# EAGLE design VCU (EAGLE 9.2.2)

## Sheet 1 of 7
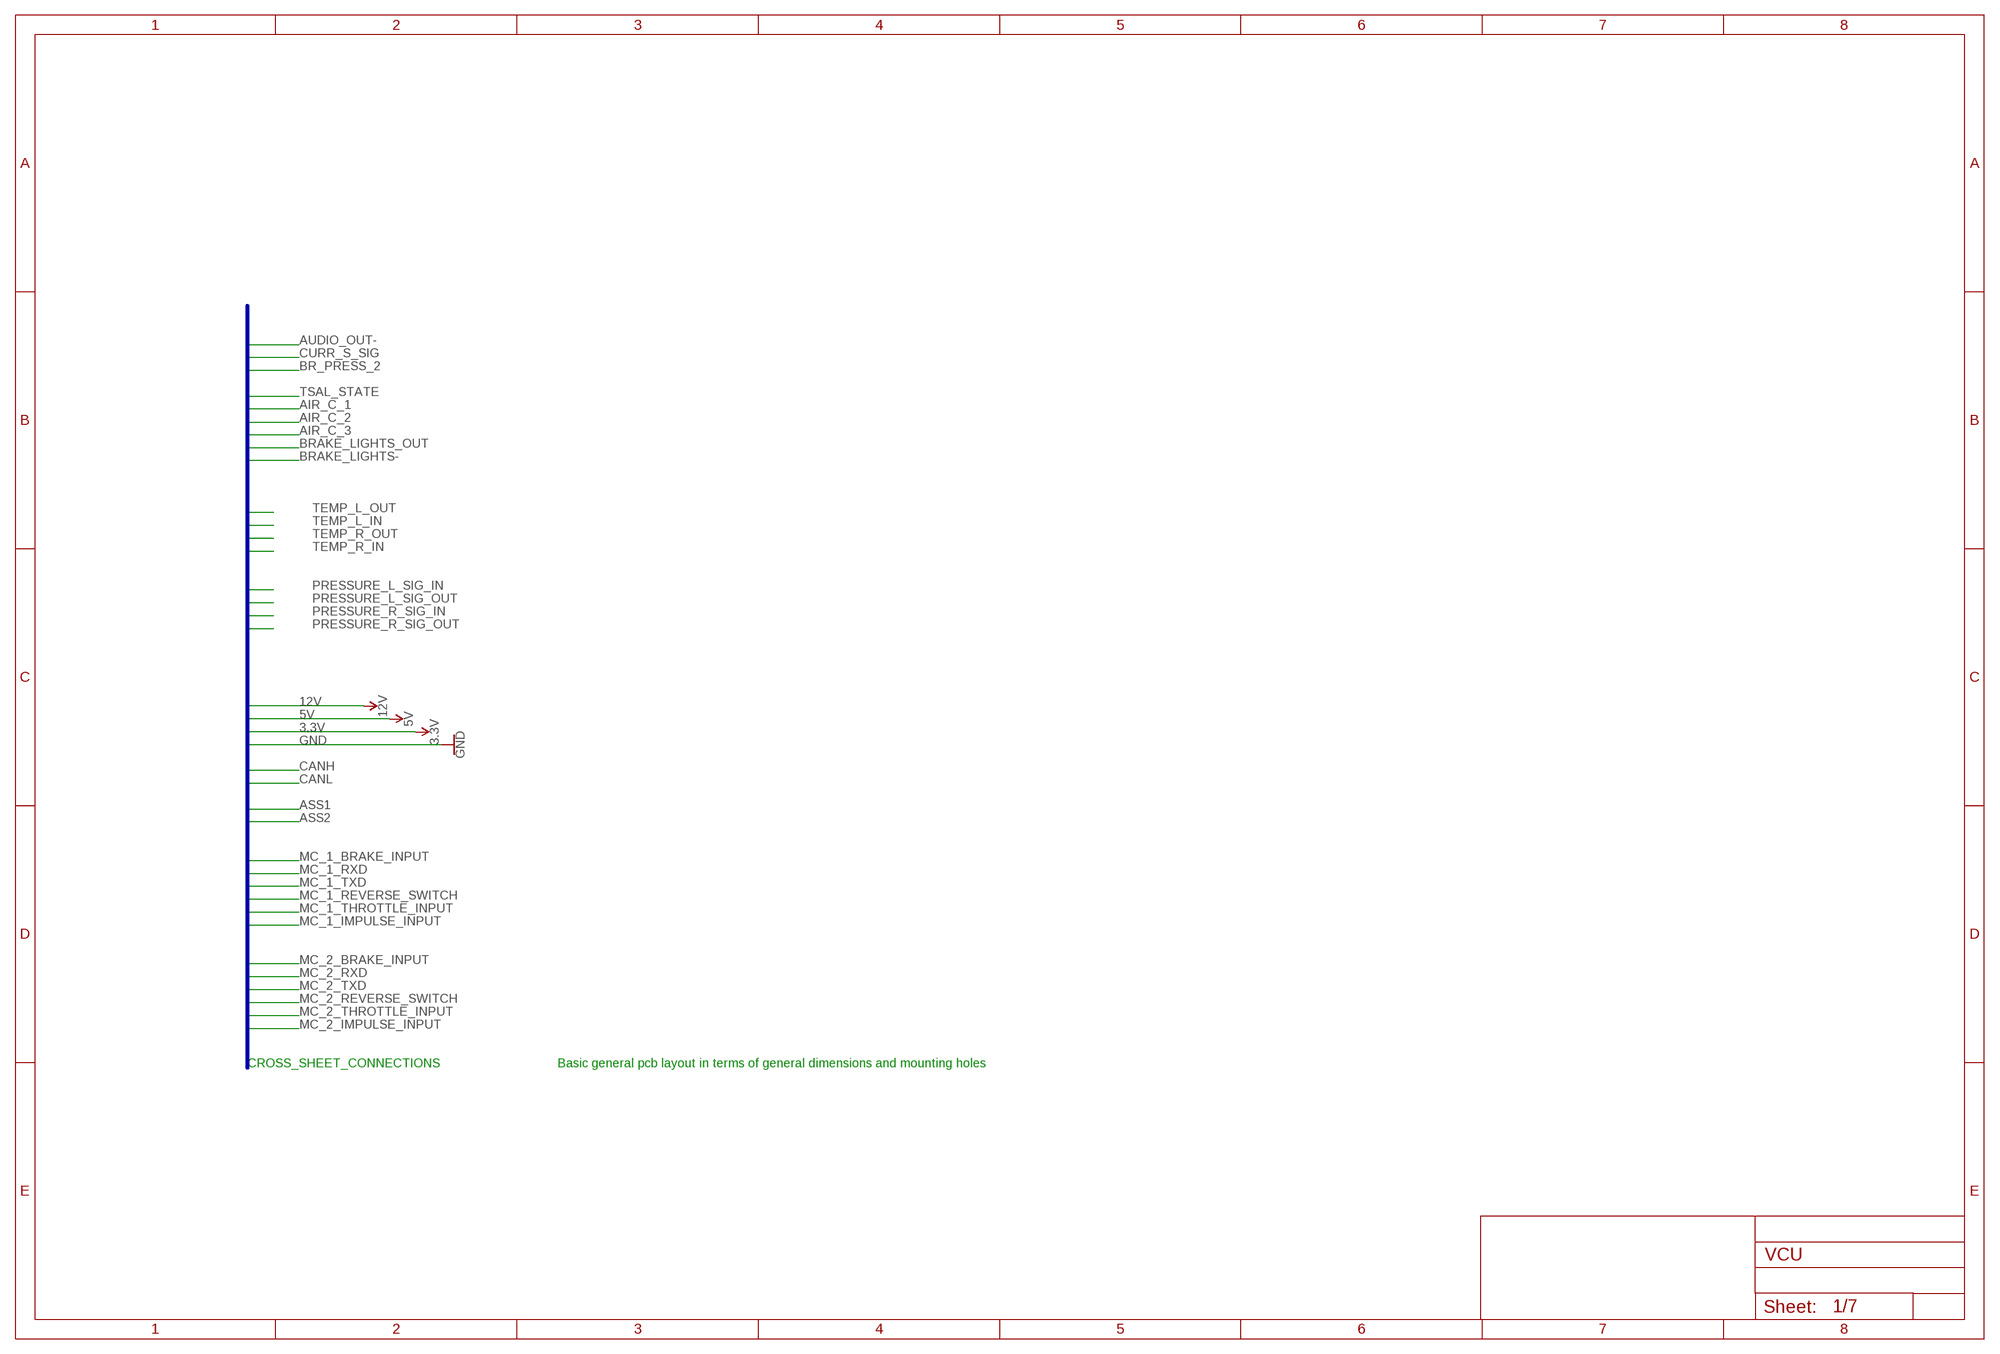
[diagram p0: schematic, sheet 1]

### Buses
3.3V,5V,12V,AIR_C_1,AIR_C_2,AIR_C_3,AIR_COILS,ASS1,ASS2,AUDIO_OUT-,BRAKE_LIGHTS+,BRAKE_LIGHTS-,BRAKE_LIGHTS_OUT,BR_PRESS_2,CANH,CANL,CURR_S_SIG,GND,MC_1_BRAKE_INPUT,MC_1_IMPULSE_INPUT,MC_1_REVERSE_SWITCH,MC_1_RXD,MC_1_THROTTLE_INPUT,MC_1_TXD,MC_2_BRAKE_INPUT,MC_2_IMPULSE_INPUT,MC_2_REVERSE_SWITCH,MC_2_RXD,MC_2_THROTTLE_INPUT,MC_2_TXD,PRESSURE_L_SIG_IN,PRESSURE_L_SIG_OUT,PRESSURE_R_SIG_IN,PRESSURE_R_SIG_OUT,TEMP_L_IN,TEMP+_L_OUT,TEMP-_L_OUT,TEMP_L_OUT,TEMP_R_IN,TEMP+_R_OUT,TEMP-_R_OUT,TEMP_R_OUT,TSAL_STATE

### Notes on the sheet
- CROSS_SHEET_CONNECTIONS | Basic general pcb layout in terms of general dimensions and mounting holes

## Sheet 2 of 7: INPUTS
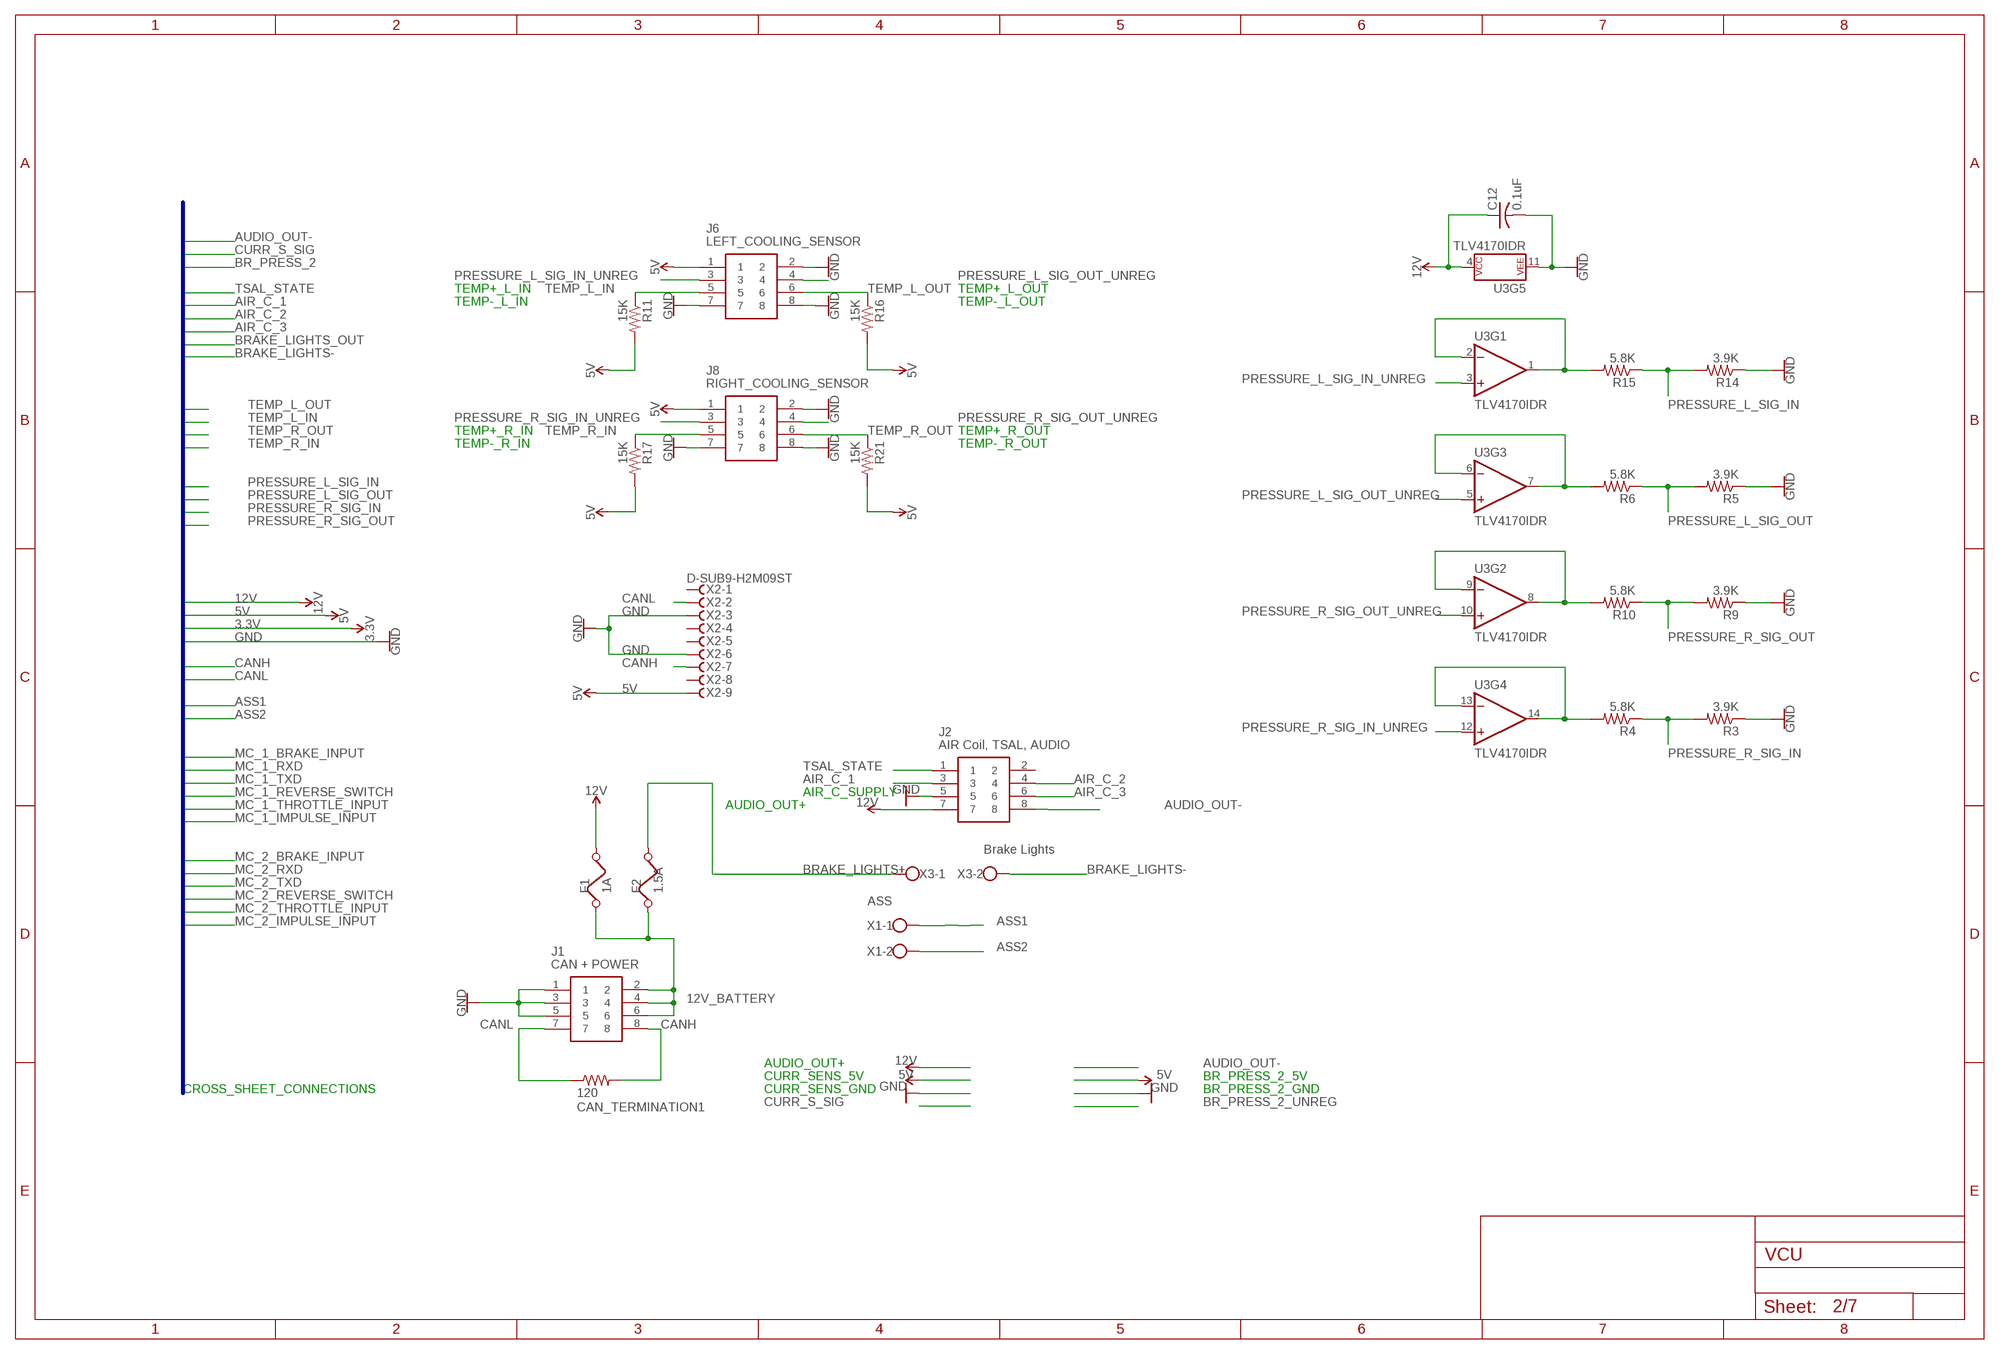
[diagram p1: schematic, sheet 2]

### Parts
C12  0.1uF  C-US050-024X044  [C050-024X044]
CAN_TERMINATION1  120  R-US_R0805  [R0805]
F1  1A  FUSE  [FUSE]
F2  1.5A  FUSE  [FUSE]
J1  CAN + POWER  T821108A1S100CEU  [HDRV8W64P254_2X4_1778X895X915P]
J2  AIR Coil, TSAL, AUDIO  T821108A1S100CEU  [HDRV8W64P254_2X4_1778X895X915P]
J6  LEFT_COOLING_SENSOR  T821108A1S100CEU  [HDRV8W64P254_2X4_1778X895X915P]
J8  RIGHT_COOLING_SENSOR  T821108A1S100CEU  [HDRV8W64P254_2X4_1778X895X915P]
R3  3.9K  R-US_R0805  [R0805]
R4  5.8K  R-US_R0805  [R0805]
R5  3.9K  R-US_R0805  [R0805]
R6  5.8K  R-US_R0805  [R0805]
R9  3.9K  R-US_R0805  [R0805]
R10  5.8K  R-US_R0805  [R0805]
R11  15K  R-US_R0805  [R0805]
R14  3.9K  R-US_R0805  [R0805]
R15  5.8K  R-US_R0805  [R0805]
R16  15K  R-US_R0805  [R0805]
R17  15K  R-US_R0805  [R0805]
R21  15K  R-US_R0805  [R0805]
U3  TLV4170IDR  LMV324  [SO14]
X1  ASS  W237-102  [W237-102]
X2  D-SUB9-H2M09ST  [H2M09ST]
X3  Brake Lights  W237-102  [W237-102]

### Nets
5V: J6.1 J8.1 R11.2 R16.2 R17.2 R21.2 X2.9 ; also sheet 1,3,4,5,6,7
12V: C12.1 F1.2 J2.7 U3.4(P$V+) ; also sheet 1,3,4,5,6,7
12V_BATTERY: F1.1 F2.1 J1.2 J1.4 J1.6
AIR_C_1: J2.3 ; also sheet 1,3,4,5,6,7
AIR_C_2: J2.4 ; also sheet 1,3,4,5,6,7
AIR_C_3: J2.6 ; also sheet 1,3,4,5,6,7
ASS1: X1.1 ; also sheet 1,3,4,5,6,7
ASS2: X1.2 ; also sheet 1,3,4,5,6,7
AUDIO_OUT-: J2.8 ; also sheet 1,3,4,5,6,7
BRAKE_LIGHTS+: F2.2 X3.1
BRAKE_LIGHTS-: X3.2 ; also sheet 1,3,4,5,6,7
CANH: CAN_TERMINATION1.2 J1.8 X2.7 ; also sheet 1,3,4,5,6,7
CANL: CAN_TERMINATION1.1 J1.7 X2.2 ; also sheet 1,3,4,5,6,7
GND: C12.2 J1.1 J1.3 J1.5 J2.5 J6.2 J6.7 J6.8 J8.2 J8.7 J8.8 R3.1 R5.1 R9.1 R14.1 U3.11(P$V-) X2.3 X2.6 ; also sheet 1,3,4,5,6,7
N$13: R4.2 U3.13(-IN) U3.14(OUT)
N$17: R6.2 U3.6(-IN) U3.7(OUT)
N$19: R10.2 U3.8(OUT) U3.9(-IN)
N$21: R15.2 U3.1(OUT) U3.2(-IN)
PRESSURE_L_SIG_IN: R14.2 R15.1 ; also sheet 1,3,4,5,6,7
PRESSURE_L_SIG_IN_UNREG: J6.3 U3.3(+IN)
PRESSURE_L_SIG_OUT: R5.2 R6.1 ; also sheet 1,3,4,5,6,7
PRESSURE_L_SIG_OUT_UNREG: J6.4 U3.5(+IN)
PRESSURE_R_SIG_IN: R3.2 R4.1 ; also sheet 1,3,4,5,6,7
PRESSURE_R_SIG_IN_UNREG: J8.3 U3.12(+IN)
PRESSURE_R_SIG_OUT: R9.2 R10.1 ; also sheet 1,3,4,5,6,7
PRESSURE_R_SIG_OUT_UNREG: J8.4 U3.10(+IN)
TEMP_L_IN: J6.5 R11.1 ; also sheet 1,3,4,5,6,7
TEMP_L_OUT: J6.6 R16.1 ; also sheet 1,3,4,5,6,7
TEMP_R_IN: J8.5 R17.1 ; also sheet 1,3,4,5,6,7
TEMP_R_OUT: J8.6 R21.1 ; also sheet 1,3,4,5,6,7
TSAL_STATE: J2.1 ; also sheet 1,3,4,5,6,7
Unconnected: J2.2 X2.1 X2.4 X2.5 X2.8

### Buses
3.3V,5V,12V,AIR_C_1,AIR_C_2,AIR_C_3,AIR_COILS,ASS1,ASS2,AUDIO_OUT-,BRAKE_LIGHTS+,BRAKE_LIGHTS-,BRAKE_LIGHTS_OUT,BR_PRESS_2,CANH,CANL,CURR_S_SIG,GND,MC_1_BRAKE_INPUT,MC_1_IMPULSE_INPUT,MC_1_REVERSE_SWITCH,MC_1_RXD,MC_1_THROTTLE_INPUT,MC_1_TXD,MC_2_BRAKE_INPUT,MC_2_IMPULSE_INPUT,MC_2_REVERSE_SWITCH,MC_2_RXD,MC_2_THROTTLE_INPUT,MC_2_TXD,PRESSURE_L_SIG_IN,PRESSURE_L_SIG_OUT,PRESSURE_R_SIG_IN,PRESSURE_R_SIG_OUT,TEMP_L_IN,TEMP+_L_OUT,TEMP-_L_OUT,TEMP_L_OUT,TEMP_R_IN,TEMP+_R_OUT,TEMP-_R_OUT,TEMP_R_OUT,TSAL_STATE

### Notes on the sheet
- TEMP+_L_IN | TEMP+_L_OUT
- TEMP-_L_IN | TEMP-_L_OUT
- TEMP+_R_IN | TEMP+_R_OUT
- TEMP-_R_IN | TEMP-_R_OUT
- AIR_C_SUPPLY
- AUDIO_OUT+
- AUDIO_OUT+
- CURR_SENS_5V | BR_PRESS_2_5V
- CROSS_SHEET_CONNECTIONS | CURR_SENS_GND | BR_PRESS_2_GND

## Sheet 3 of 7: POWER DELIVERY
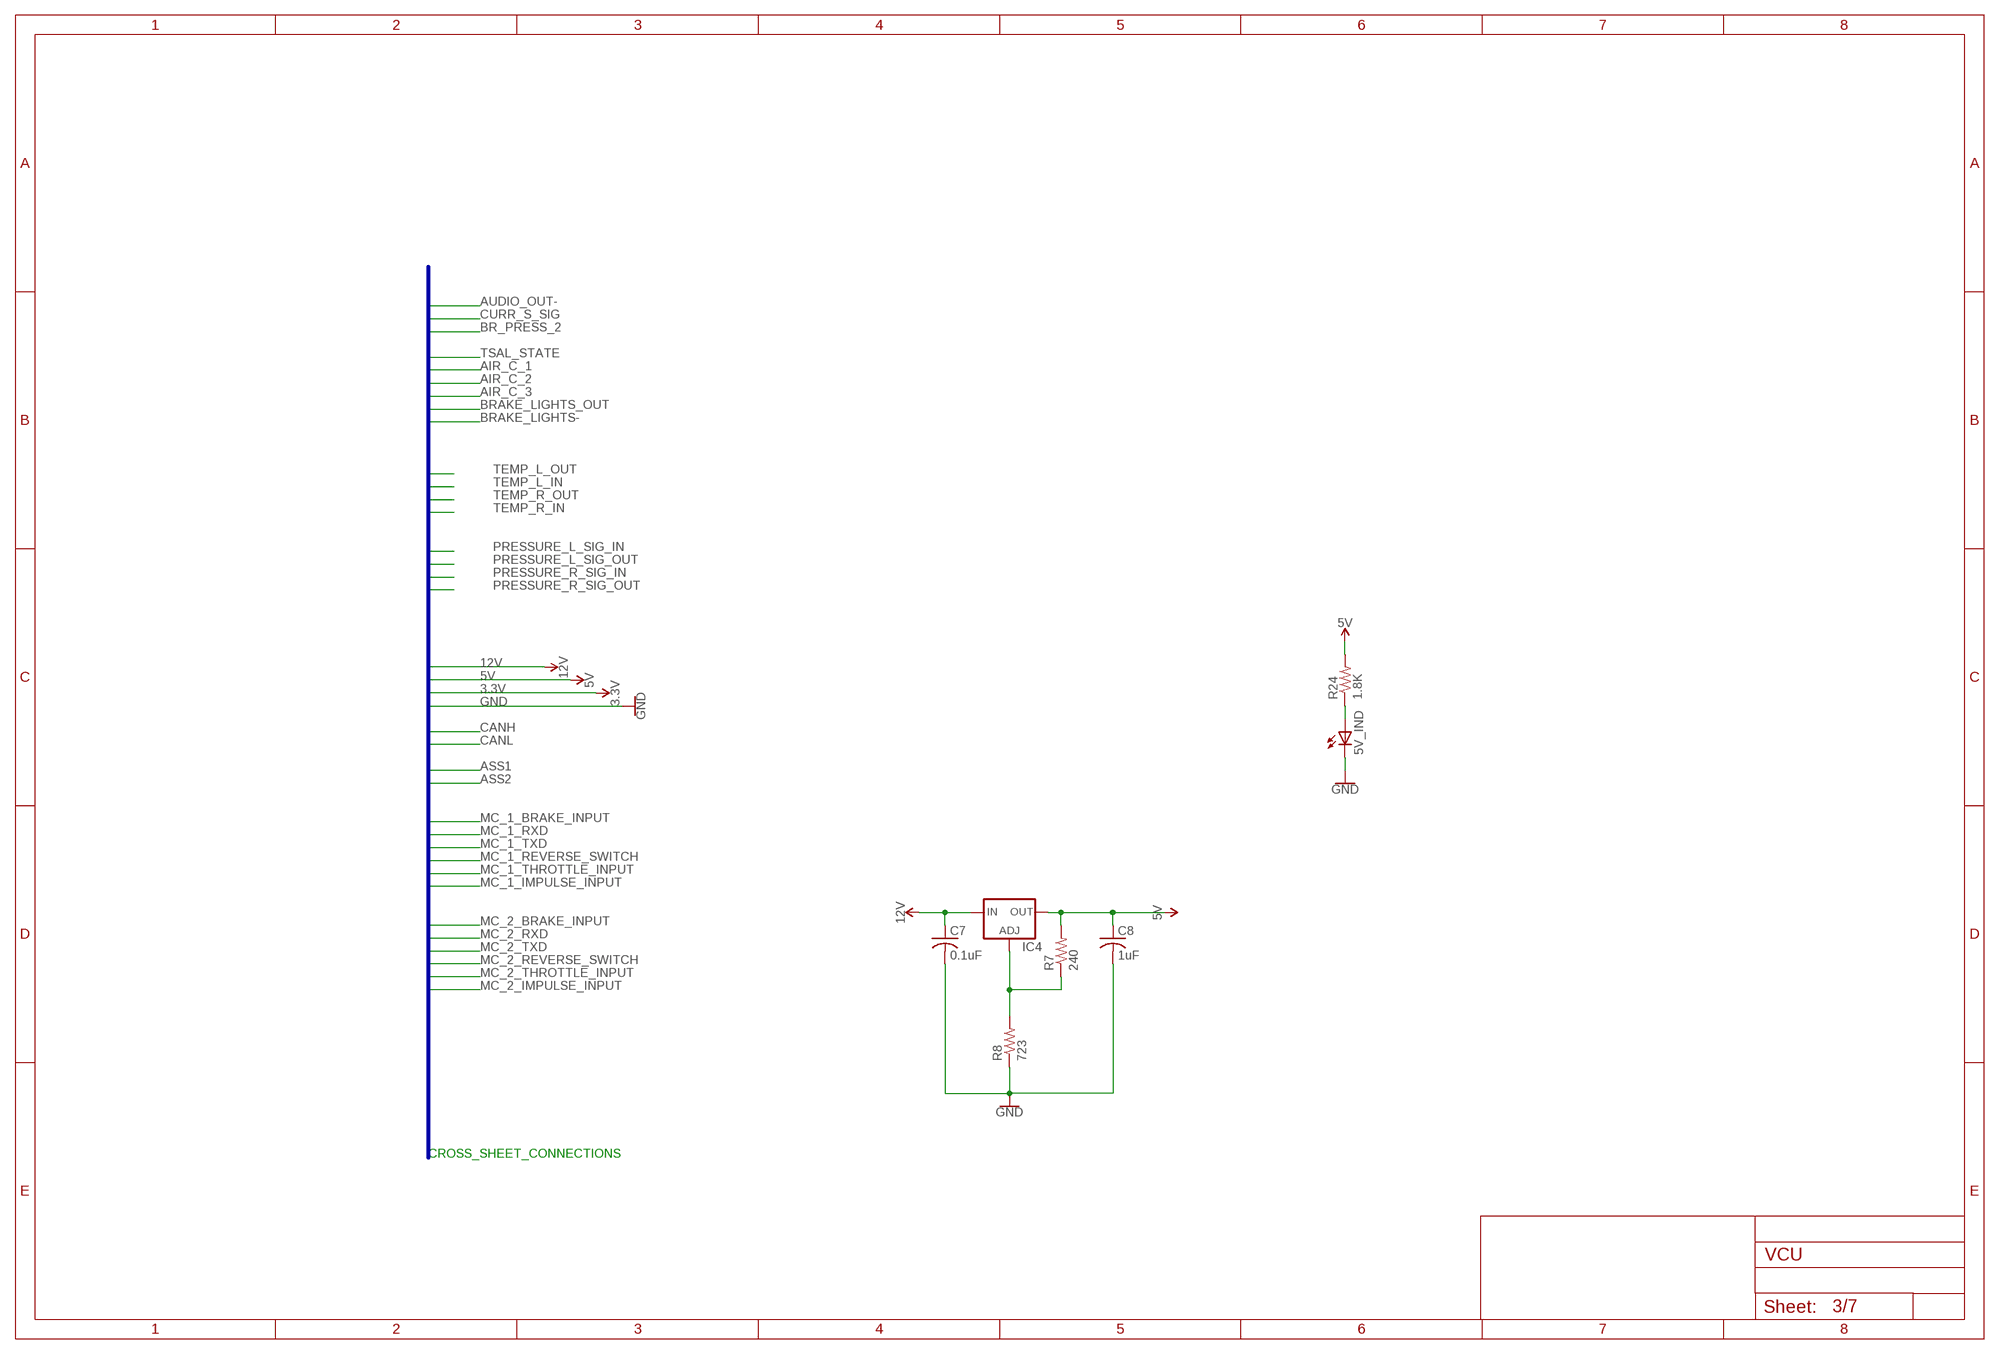
[diagram p2: schematic, sheet 3]

### Parts
5V_IND  LED3MM  [LED3MM]
C7  0.1uF  C-US050-025X075  [C050-025X075]
C8  1uF  C-US050-025X075  [C050-025X075]
IC4  LM317TS  [317TS]
R7  240  R-US_R0805  [R0805]
R8  723  R-US_R0805  [R0805]
R24  1.8K  R-US_R0805  [R0805]

### Nets
5V: C8.1 IC4.2(OUT) R7.2 R24.2 ; also sheet 1,2,4,5,6,7
12V: C7.1 IC4.3(IN) ; also sheet 1,2,4,5,6,7
GND: 5V_IND.K(C) C7.2 C8.2 R8.1 ; also sheet 1,2,4,5,6,7
N$2: 5V_IND.A R24.1
N$4: IC4.1(ADJ) R7.1 R8.2

### Buses
3.3V,5V,12V,AIR_C_1,AIR_C_2,AIR_C_3,AIR_COILS,ASS1,ASS2,AUDIO_OUT-,BRAKE_LIGHTS+,BRAKE_LIGHTS-,BRAKE_LIGHTS_OUT,BR_PRESS_2,CANH,CANL,CURR_S_SIG,GND,MC_1_BRAKE_INPUT,MC_1_IMPULSE_INPUT,MC_1_REVERSE_SWITCH,MC_1_RXD,MC_1_THROTTLE_INPUT,MC_1_TXD,MC_2_BRAKE_INPUT,MC_2_IMPULSE_INPUT,MC_2_REVERSE_SWITCH,MC_2_RXD,MC_2_THROTTLE_INPUT,MC_2_TXD,PRESSURE_L_SIG_IN,PRESSURE_L_SIG_OUT,PRESSURE_R_SIG_IN,PRESSURE_R_SIG_OUT,TEMP_L_IN,TEMP+_L_OUT,TEMP-_L_OUT,TEMP_L_OUT,TEMP_R_IN,TEMP+_R_OUT,TEMP-_R_OUT,TEMP_R_OUT,TSAL_STATE

### Notes on the sheet
- CROSS_SHEET_CONNECTIONS

## Sheet 4 of 7: MICROCONTROLLER
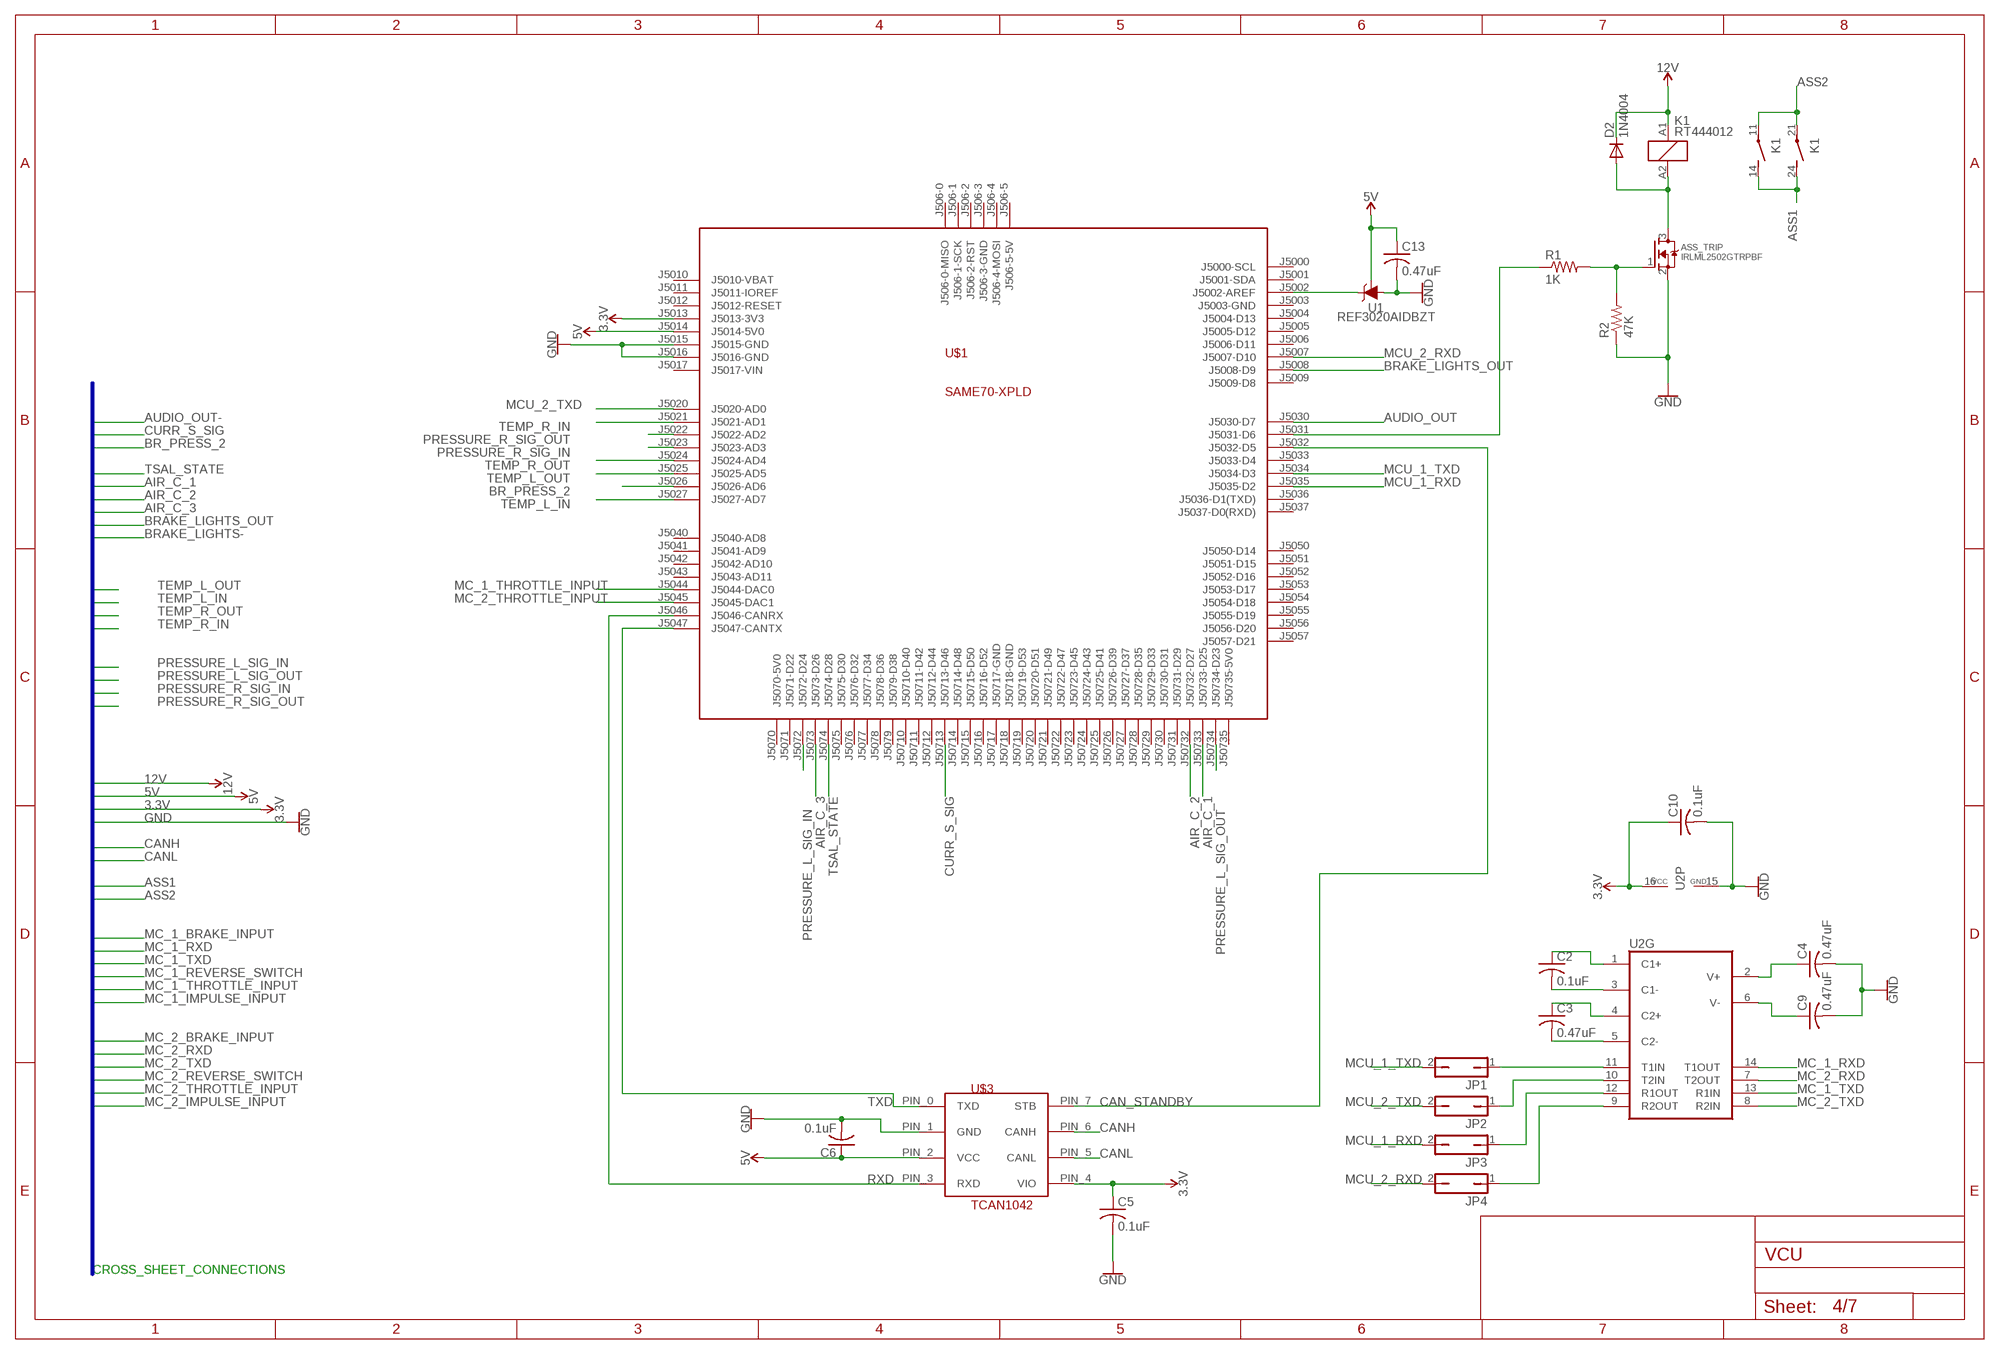
[diagram p3: schematic, sheet 4]

### Parts
ASS_TRIP  IRLML2502GTRPBF  MOSFET-NREFLOW  [SOT23]
C2  0.1uF  C-US025-024X044  [C025-024X044]
C3  0.47uF  C-US025-024X044  [C025-024X044]
C4  0.47uF  C-US025-024X044  [C025-024X044]
C5  0.1uF  C-US025-024X044  [C025-024X044]
C6  0.1uF  C-US025-024X044  [C025-024X044]
C9  0.47uF  C-US025-024X044  [C025-024X044]
C10  0.1uF  C-US025-024X044  [C025-024X044]
C13  0.47uF  C-US050-024X044  [C050-024X044]
D2  1N4004  [DO41-10]
JP1  JP1Q  [JP1]
JP2  JP1Q  [JP1]
JP3  JP1Q  [JP1]
JP4  JP1Q  [JP1]
K1  RT444012  [RT2N/O]
R1  1K  R-US_R0805  [R0805]
R2  47K  R-US_R0805  [R0805]
U1  REF3020AIDBZT  LM4051  [SOT23-3]
U2  MAX3232S  [SO16]
U$1  SAME70-XPLD  [SAME70-XPLD]
U$3  TCAN1042  [TCAN1042]

### Nets
3.3V: C5.1 C10.1 U2.16(P:VCC) U$1.J5013(J5013-3V3) U$3.PIN_4(VIO) ; also sheet 1,2,3,5,6,7
5V: C6.1 C13.1 U1.1(ADJ) U$1.J5014(J5014-5V0) U$3.PIN_2(VCC) ; also sheet 1,2,3,5,6,7
12V: D2.C K1.A1 ; also sheet 1,2,3,5,6,7
AIR_C_1: U$1.J50733(J50733-D25) ; also sheet 1,2,3,5,6,7
AIR_C_2: U$1.J50732(J50732-D27) ; also sheet 1,2,3,5,6,7
AIR_C_3: U$1.J5073(J5073-D26) ; also sheet 1,2,3,5,6,7
ASS1: K1.14(2:S) K1.24(3:S) ; also sheet 1,2,3,5,6,7
ASS2: K1.11(2:P) K1.21(3:P) ; also sheet 1,2,3,5,6,7
AUDIO_OUT: U$1.J5030(J5030-D7) ; also sheet 7
BR_PRESS_2: U$1.J5026(J5026-AD6) ; also sheet 1,2,3,5,6,7
BRAKE_LIGHTS_OUT: U$1.J5008(J5008-D9) ; also sheet 1,2,3,5,6,7
CAN_STANDBY: U$1.J5032(J5032-D5) U$3.PIN_7(STB)
CANH: U$3.PIN_6(CANH) ; also sheet 1,2,3,5,6,7
CANL: U$3.PIN_5(CANL) ; also sheet 1,2,3,5,6,7
CURR_S_SIG: U$1.J50713(J50713-D46) ; also sheet 1,2,3,5,6,7
GND: ASS_TRIP.2(S) C4.2 C5.2 C6.2 C9.2 C10.2 C13.2 R2.1 U1.3(A) U2.15(P:GND) U$1.J5015(J5015-GND) U$1.J5016(J5016-GND) U$3.PIN_1(GND) ; also sheet 1,2,3,5,6,7
MC_1_RXD: U2.14(G:T1OUT) ; also sheet 1,2,3,5,6,7
MC_1_THROTTLE_INPUT: U$1.J5044(J5044-DAC0) ; also sheet 1,2,3,5,6,7
MC_1_TXD: U2.13(G:R1IN) ; also sheet 1,2,3,5,6,7
MC_2_RXD: U2.7(G:T2OUT) ; also sheet 1,2,3,5,6,7
MC_2_THROTTLE_INPUT: U$1.J5045(J5045-DAC1) ; also sheet 1,2,3,5,6,7
MC_2_TXD: U2.8(G:R2IN) ; also sheet 1,2,3,5,6,7
MCU_1_RXD: JP3.2 U$1.J5035(J5035-D2)
MCU_1_TXD: JP1.2 U$1.J5034(J5034-D3)
MCU_2_RXD: JP4.2 U$1.J5007(J5007-D10)
MCU_2_TXD: JP2.2 U$1.J5020(J5020-AD0)
N$1: R1.1 U$1.J5031(J5031-D6)
N$3: ASS_TRIP.1(G) R1.2 R2.2
N$6: ASS_TRIP.3(D) D2.A K1.A2
N$8: C3.2 U2.5(G:C2-)
N$9: C3.1 U2.4(G:C2+)
N$10: C2.2 U2.3(G:C1-)
N$11: C2.1 U2.1(G:C1+)
N$12: U1.2(C) U$1.J5002(J5002-AREF)
N$14: C4.1 U2.2(G:V+)
N$15: C9.1 U2.6(G:V-)
N$16: JP1.1 U2.11(G:T1IN)
N$18: JP2.1 U2.10(G:T2IN)
N$20: JP3.1 U2.12(G:R1OUT)
N$22: JP4.1 U2.9(G:R2OUT)
PRESSURE_L_SIG_IN: U$1.J5072(J5072-D24) ; also sheet 1,2,3,5,6,7
PRESSURE_L_SIG_OUT: U$1.J50734(J50734-D23) ; also sheet 1,2,3,5,6,7
PRESSURE_R_SIG_IN: U$1.J5023(J5023-AD3) ; also sheet 1,2,3,5,6,7
PRESSURE_R_SIG_OUT: U$1.J5022(J5022-AD2) ; also sheet 1,2,3,5,6,7
RXD: U$1.J5046(J5046-CANRX) U$3.PIN_3(RXD)
TEMP_L_IN: U$1.J5027(J5027-AD7) ; also sheet 1,2,3,5,6,7
TEMP_L_OUT: U$1.J5025(J5025-AD5) ; also sheet 1,2,3,5,6,7
TEMP_R_IN: U$1.J5021(J5021-AD1) ; also sheet 1,2,3,5,6,7
TEMP_R_OUT: U$1.J5024(J5024-AD4) ; also sheet 1,2,3,5,6,7
TSAL_STATE: U$1.J5074(J5074-D28) ; also sheet 1,2,3,5,6,7
TXD: U$1.J5047(J5047-CANTX) U$3.PIN_0(TXD)
Unconnected: U$1.J506-0(J506-0-MISO) U$1.J506-1(J506-1-SCK) U$1.J506-2(J506-2-RST) U$1.J506-3(J506-3-GND) U$1.J506-4(J506-4-MOSI) U$1.J506-5(J506-5-5V) U$1.J5000(J5000-SCL) U$1.J5001(J5001-SDA) U$1.J5003(J5003-GND) U$1.J5004(J5004-D13) U$1.J5005(J5005-D12) U$1.J5006(J5006-D11) U$1.J5009(J5009-D8) U$1.J5010(J5010-VBAT) U$1.J5011(J5011-IOREF) U$1.J5012(J5012-RESET) U$1.J5017(J5017-VIN) U$1.J5033(J5033-D4) U$1.J5036(J5036-D1(TXD)) U$1.J5037(J5037-D0(RXD)) U$1.J5040(J5040-AD8) U$1.J5041(J5041-AD9) U$1.J5042(J5042-AD10) U$1.J5043(J5043-AD11) U$1.J5050(J5050-D14) U$1.J5051(J5051-D15) U$1.J5052(J5052-D16) U$1.J5053(J5053-D17) U$1.J5054(J5054-D18) U$1.J5055(J5055-D19) U$1.J5056(J5056-D20) U$1.J5057(J5057-D21) U$1.J5070(J5070-5V0) U$1.J5071(J5071-D22) U$1.J5075(J5075-D30) U$1.J5076(J5076-D32) U$1.J5077(J5077-D34) U$1.J5078(J5078-D36) U$1.J5079(J5079-D38) U$1.J50710(J50710-D40) U$1.J50711(J50711-D42) U$1.J50712(J50712-D44) U$1.J50714(J50714-D48) U$1.J50715(J50715-D50) U$1.J50716(J50716-D52) U$1.J50717(J50717-GND) U$1.J50718(J50718-GND) U$1.J50719(J50719-D53) U$1.J50720(J50720-D51) U$1.J50721(J50721-D49) U$1.J50722(J50722-D47) U$1.J50723(J50723-D45) U$1.J50724(J50724-D43) U$1.J50725(J50725-D41) U$1.J50726(J50726-D39) U$1.J50727(J50727-D37) U$1.J50728(J50728-D35) U$1.J50729(J50729-D33) U$1.J50730(J50730-D31) U$1.J50731(J50731-D29) U$1.J50735(J50735-5V0)

### Buses
3.3V,5V,12V,AIR_C_1,AIR_C_2,AIR_C_3,AIR_COILS,ASS1,ASS2,AUDIO_OUT-,BRAKE_LIGHTS+,BRAKE_LIGHTS-,BRAKE_LIGHTS_OUT,BR_PRESS_2,CANH,CANL,CURR_S_SIG,GND,MC_1_BRAKE_INPUT,MC_1_IMPULSE_INPUT,MC_1_REVERSE_SWITCH,MC_1_RXD,MC_1_THROTTLE_INPUT,MC_1_TXD,MC_2_BRAKE_INPUT,MC_2_IMPULSE_INPUT,MC_2_REVERSE_SWITCH,MC_2_RXD,MC_2_THROTTLE_INPUT,MC_2_TXD,PRESSURE_L_SIG_IN,PRESSURE_L_SIG_OUT,PRESSURE_R_SIG_IN,PRESSURE_R_SIG_OUT,TEMP_L_IN,TEMP+_L_OUT,TEMP-_L_OUT,TEMP_L_OUT,TEMP_R_IN,TEMP+_R_OUT,TEMP-_R_OUT,TEMP_R_OUT,TSAL_STATE

### Notes on the sheet
- CROSS_SHEET_CONNECTIONS

## Sheet 5 of 7: MOTOR CONTROLLER LEFT OUTPUT
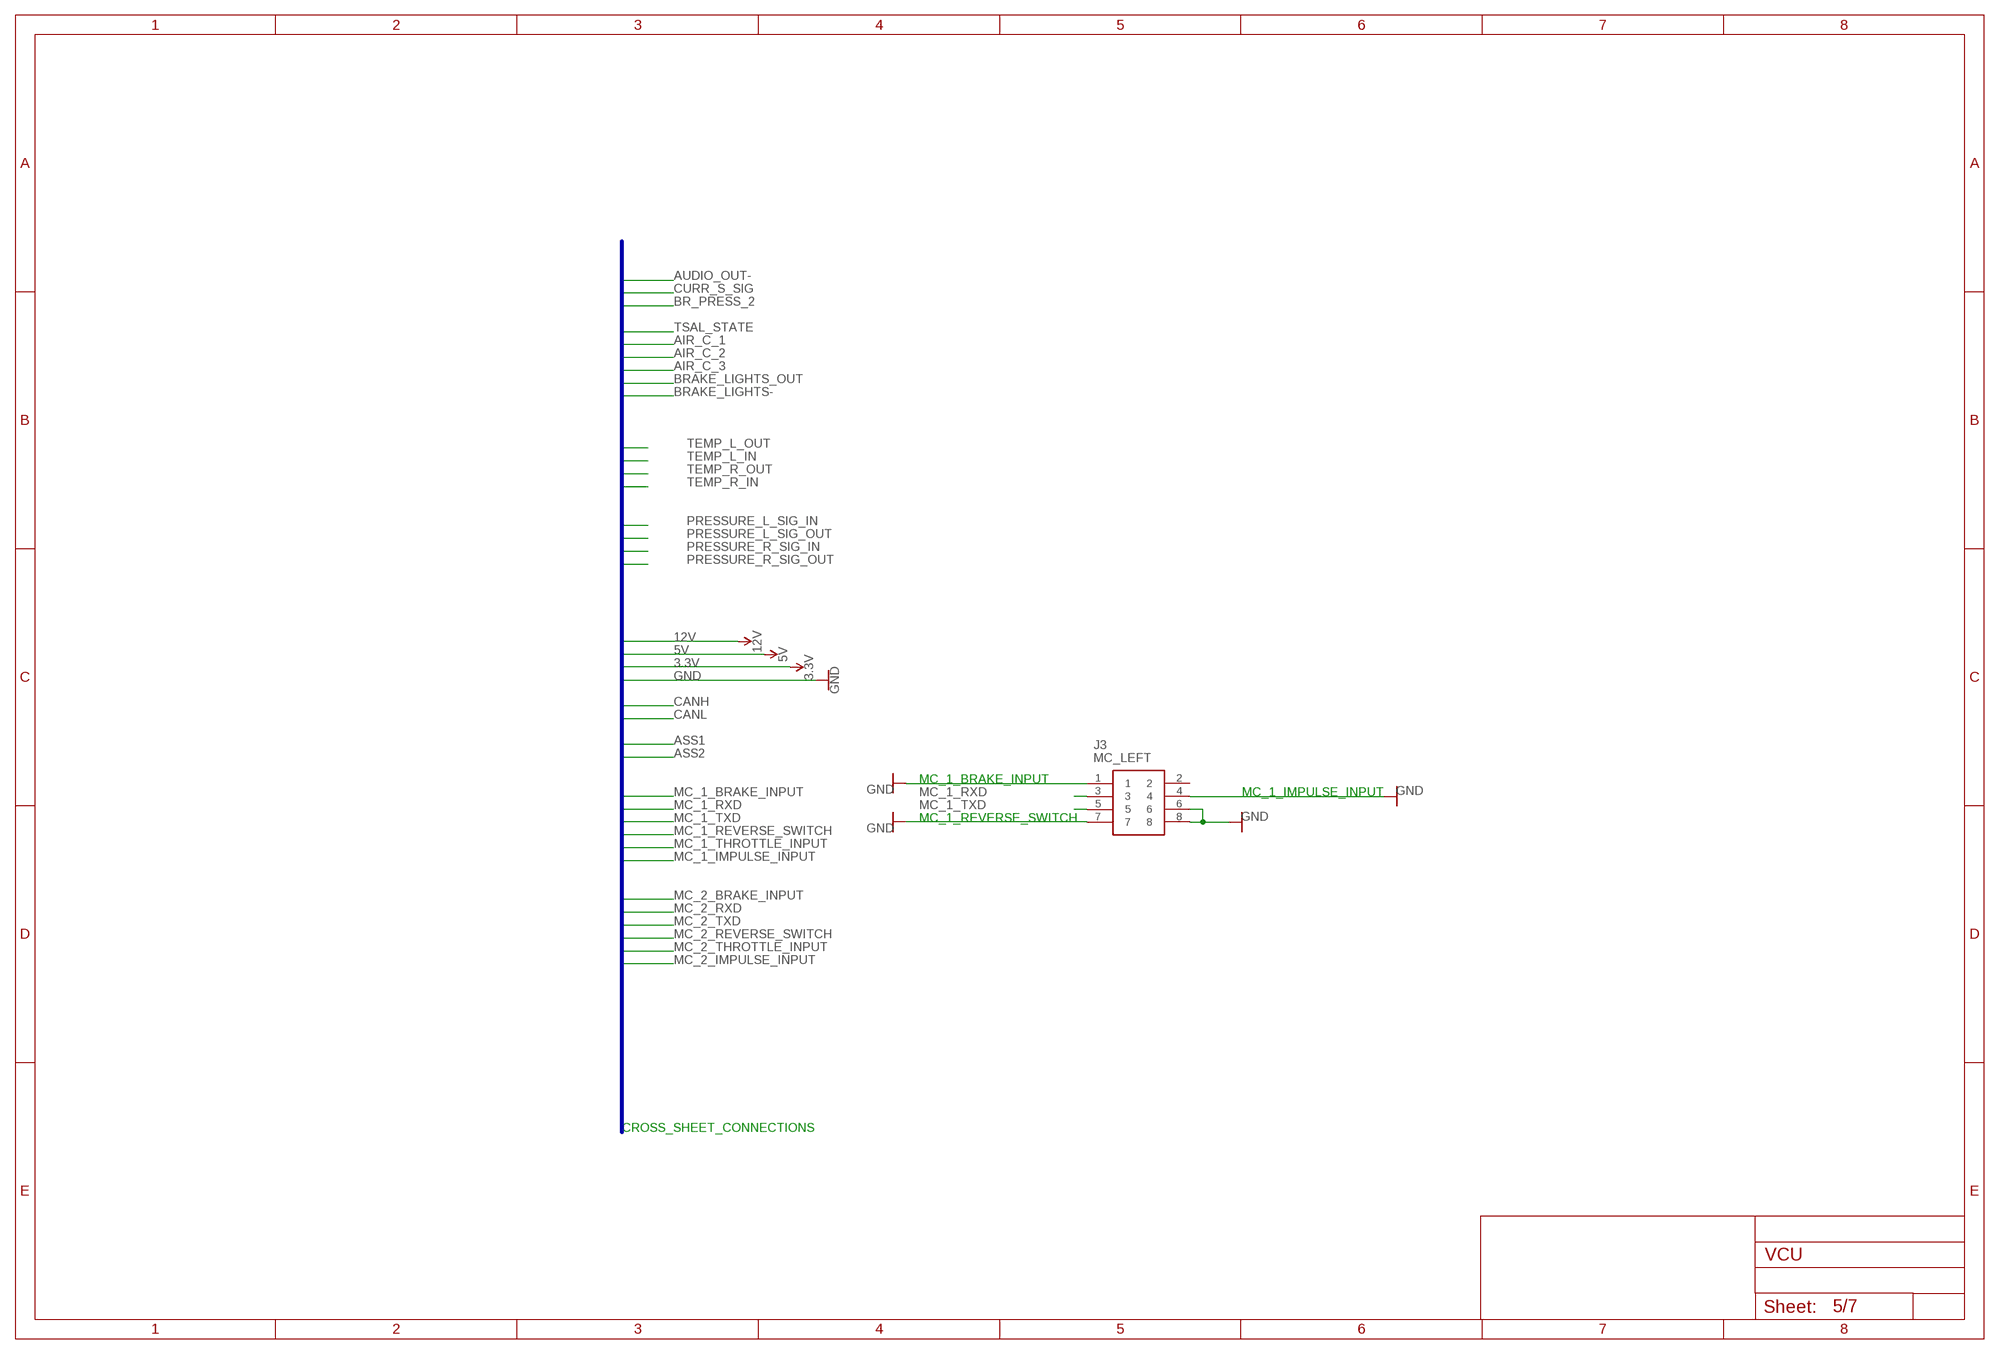
[diagram p4: schematic, sheet 5]

### Parts
J3  MC_LEFT  T821108A1S100CEU  [HDRV8W64P254_2X4_1778X895X915P]

### Nets
GND: J3.1 J3.4 J3.6 J3.7 J3.8 ; also sheet 1,2,3,4,6,7
MC_1_RXD: J3.3 ; also sheet 1,2,3,4,6,7
MC_1_TXD: J3.5 ; also sheet 1,2,3,4,6,7
Unconnected: J3.2

### Buses
3.3V,5V,12V,AIR_C_1,AIR_C_2,AIR_C_3,AIR_COILS,ASS1,ASS2,AUDIO_OUT-,BRAKE_LIGHTS+,BRAKE_LIGHTS-,BRAKE_LIGHTS_OUT,BR_PRESS_2,CANH,CANL,CURR_S_SIG,GND,MC_1_BRAKE_INPUT,MC_1_IMPULSE_INPUT,MC_1_REVERSE_SWITCH,MC_1_RXD,MC_1_THROTTLE_INPUT,MC_1_TXD,MC_2_BRAKE_INPUT,MC_2_IMPULSE_INPUT,MC_2_REVERSE_SWITCH,MC_2_RXD,MC_2_THROTTLE_INPUT,MC_2_TXD,PRESSURE_L_SIG_IN,PRESSURE_L_SIG_OUT,PRESSURE_R_SIG_IN,PRESSURE_R_SIG_OUT,TEMP_L_IN,TEMP+_L_OUT,TEMP-_L_OUT,TEMP_L_OUT,TEMP_R_IN,TEMP+_R_OUT,TEMP-_R_OUT,TEMP_R_OUT,TSAL_STATE

### Notes on the sheet
- MC_1_BRAKE_INPUT
- MC_1_IMPULSE_INPUT
- MC_1_REVERSE_SWITCH
- CROSS_SHEET_CONNECTIONS

## Sheet 6 of 7: MOTOR CONTROLLER RIGHT OUTPUT
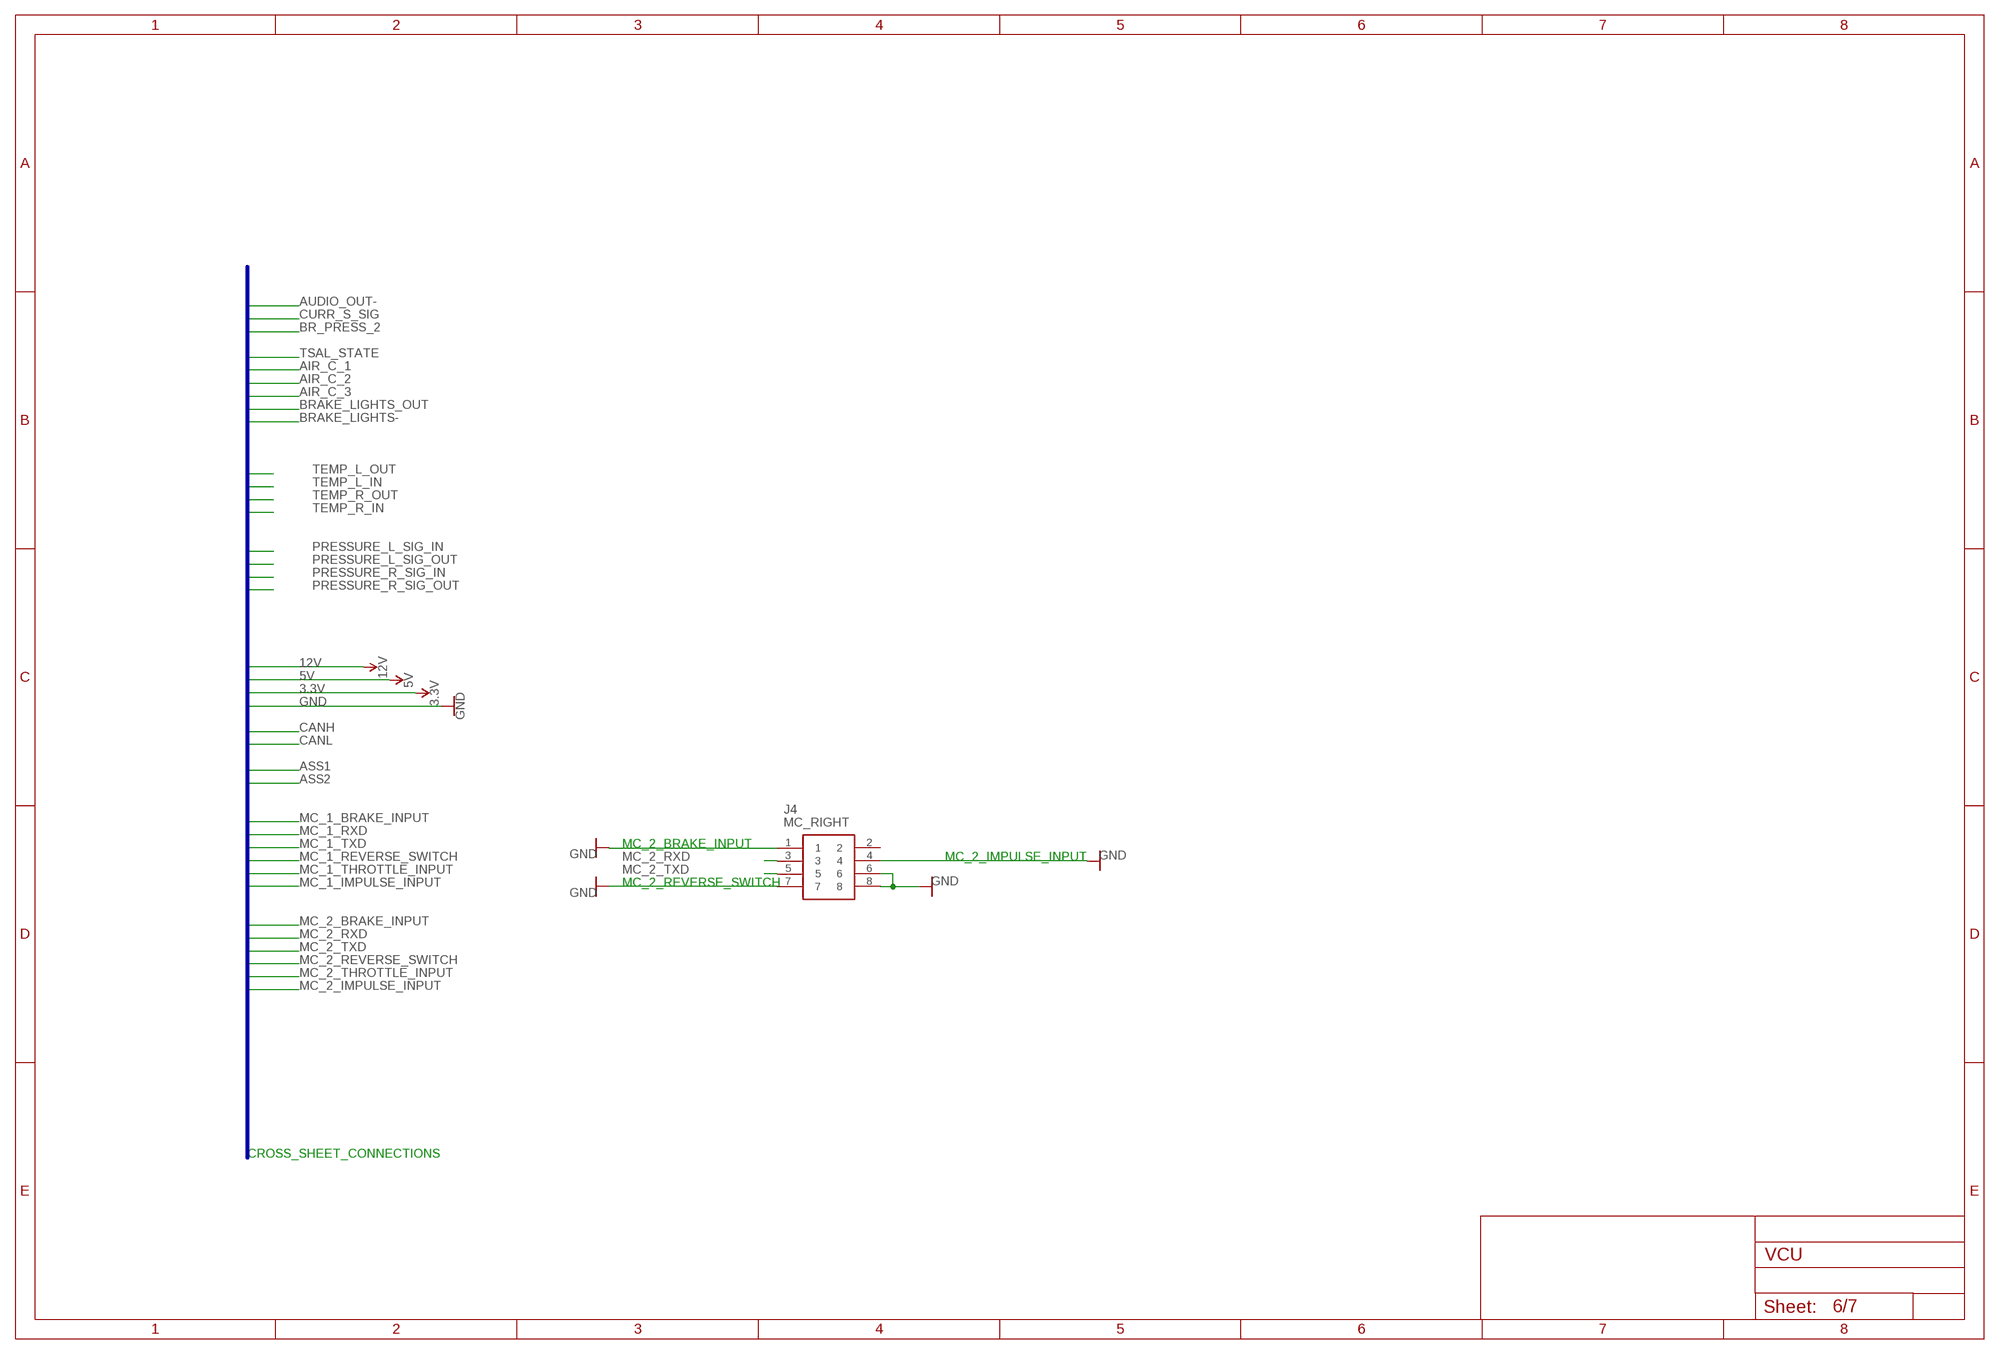
[diagram p5: schematic, sheet 6]

### Parts
J4  MC_RIGHT  T821108A1S100CEU  [HDRV8W64P254_2X4_1778X895X915P]

### Nets
GND: J4.1 J4.4 J4.6 J4.7 J4.8 ; also sheet 1,2,3,4,5,7
MC_2_RXD: J4.3 ; also sheet 1,2,3,4,5,7
MC_2_TXD: J4.5 ; also sheet 1,2,3,4,5,7
Unconnected: J4.2

### Buses
3.3V,5V,12V,AIR_C_1,AIR_C_2,AIR_C_3,AIR_COILS,ASS1,ASS2,AUDIO_OUT-,BRAKE_LIGHTS+,BRAKE_LIGHTS-,BRAKE_LIGHTS_OUT,BR_PRESS_2,CANH,CANL,CURR_S_SIG,GND,MC_1_BRAKE_INPUT,MC_1_IMPULSE_INPUT,MC_1_REVERSE_SWITCH,MC_1_RXD,MC_1_THROTTLE_INPUT,MC_1_TXD,MC_2_BRAKE_INPUT,MC_2_IMPULSE_INPUT,MC_2_REVERSE_SWITCH,MC_2_RXD,MC_2_THROTTLE_INPUT,MC_2_TXD,PRESSURE_L_SIG_IN,PRESSURE_L_SIG_OUT,PRESSURE_R_SIG_IN,PRESSURE_R_SIG_OUT,TEMP_L_IN,TEMP+_L_OUT,TEMP-_L_OUT,TEMP_L_OUT,TEMP_R_IN,TEMP+_R_OUT,TEMP-_R_OUT,TEMP_R_OUT,TSAL_STATE

### Notes on the sheet
- MC_2_BRAKE_INPUT
- MC_2_IMPULSE_INPUT
- MC_2_REVERSE_SWITCH
- CROSS_SHEET_CONNECTIONS

## Sheet 7 of 7: BRAKE LIGHTS
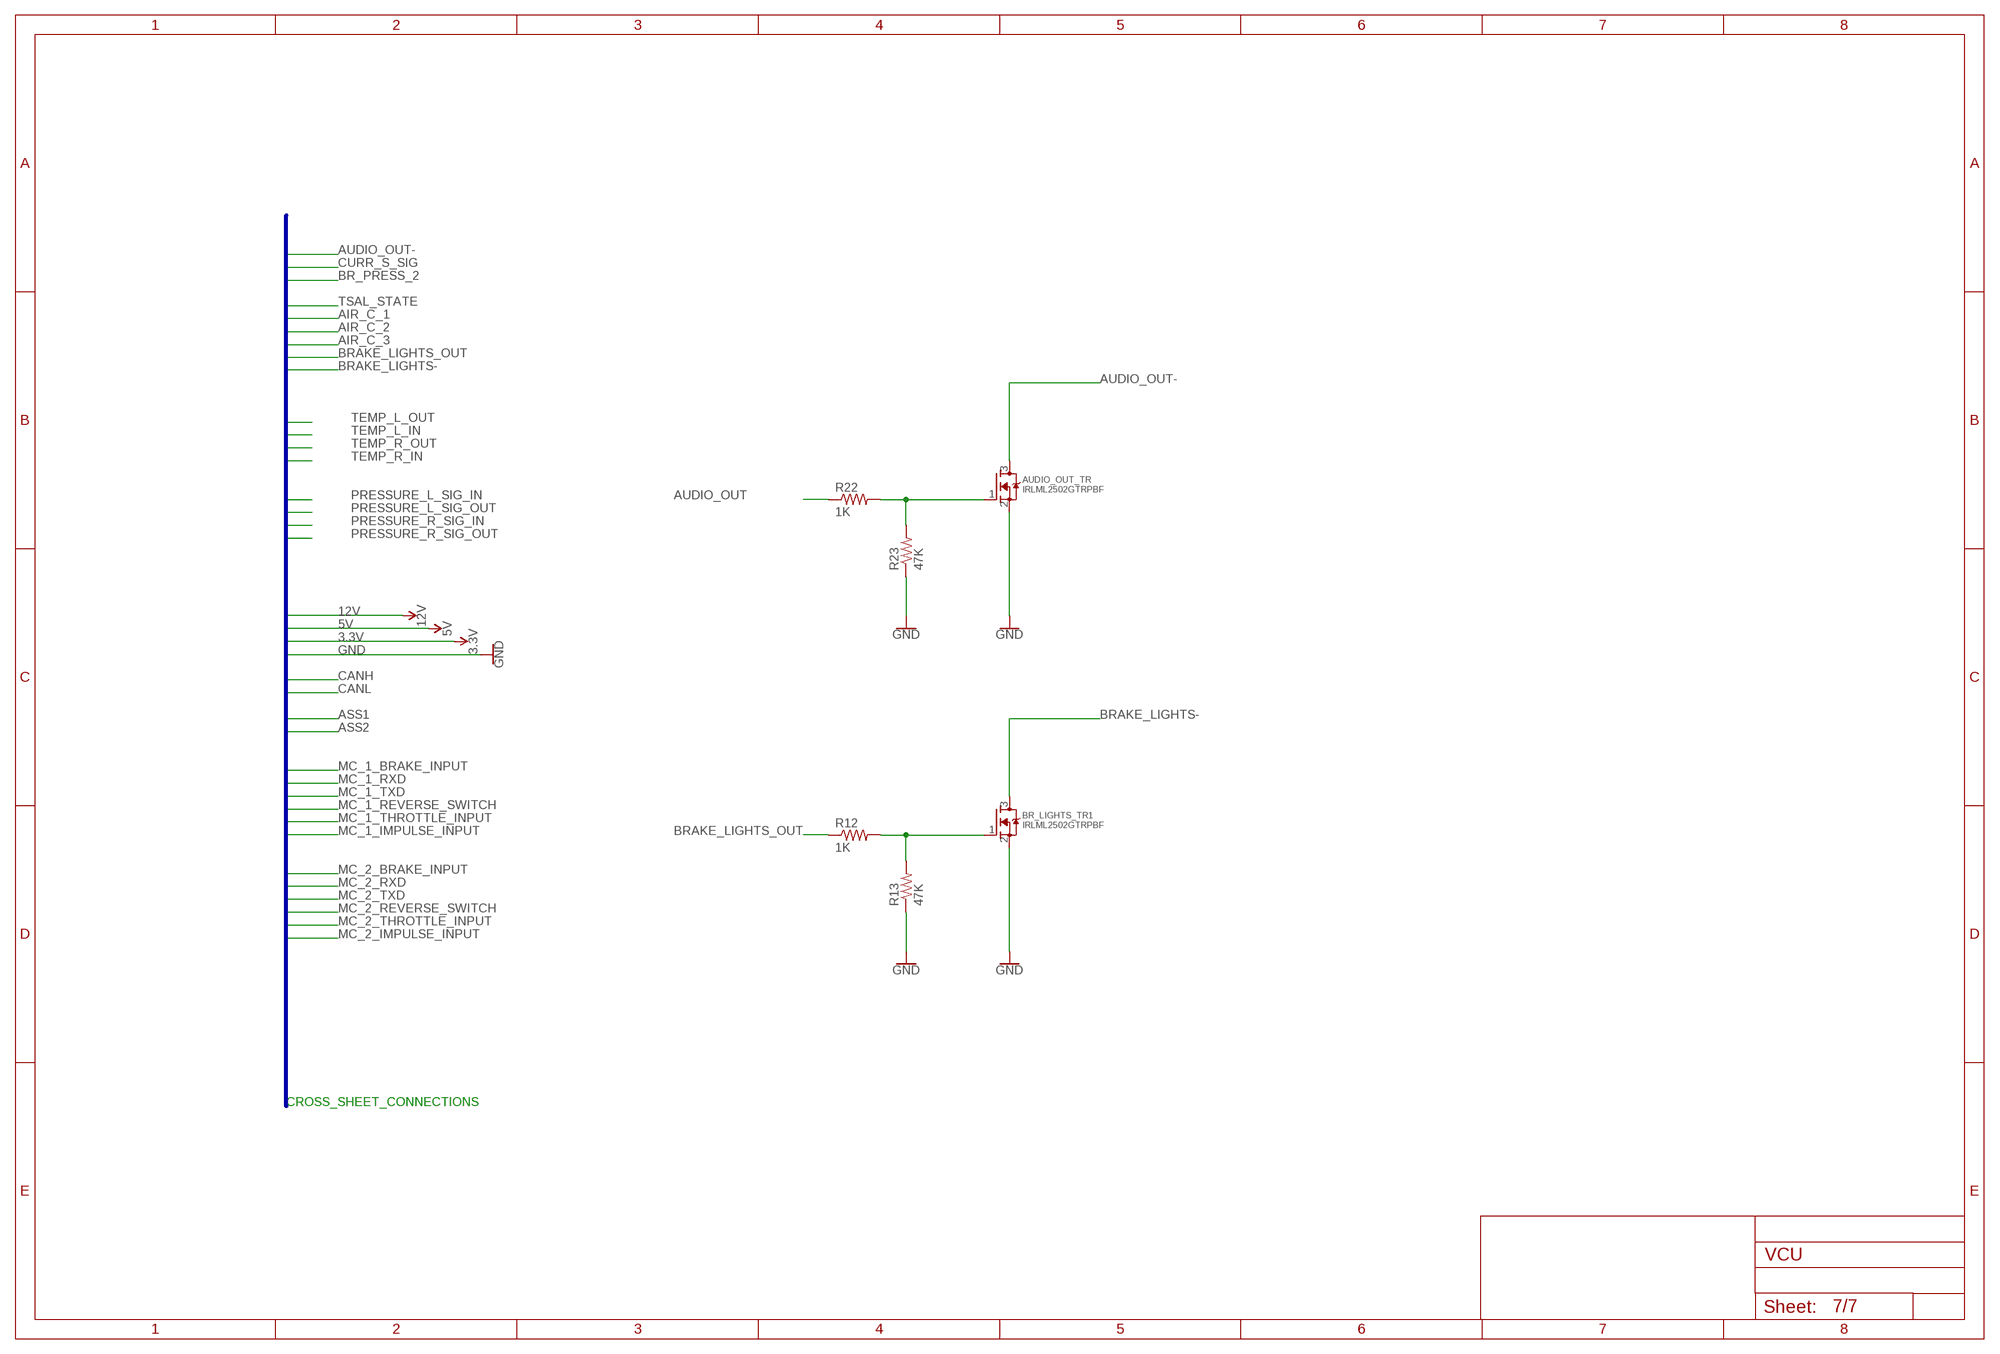
[diagram p6: schematic, sheet 7]

### Parts
AUDIO_OUT_TR  IRLML2502GTRPBF  MOSFET-NREFLOW  [SOT23]
BR_LIGHTS_TR1  IRLML2502GTRPBF  MOSFET-NREFLOW  [SOT23]
R12  1K  R-US_R0805  [R0805]
R13  47K  R-US_R0805  [R0805]
R22  1K  R-US_R0805  [R0805]
R23  47K  R-US_R0805  [R0805]

### Nets
AUDIO_OUT: R22.1 ; also sheet 4
AUDIO_OUT-: AUDIO_OUT_TR.3(D) ; also sheet 1,2,3,4,5,6
BRAKE_LIGHTS-: BR_LIGHTS_TR1.3(D) ; also sheet 1,2,3,4,5,6
BRAKE_LIGHTS_OUT: R12.1 ; also sheet 1,2,3,4,5,6
GND: AUDIO_OUT_TR.2(S) BR_LIGHTS_TR1.2(S) R13.1 R23.1 ; also sheet 1,2,3,4,5,6
N$23: AUDIO_OUT_TR.1(G) R22.2 R23.2
N$25: BR_LIGHTS_TR1.1(G) R12.2 R13.2

### Buses
3.3V,5V,12V,AIR_C_1,AIR_C_2,AIR_C_3,AIR_COILS,ASS1,ASS2,AUDIO_OUT-,BRAKE_LIGHTS+,BRAKE_LIGHTS-,BRAKE_LIGHTS_OUT,BR_PRESS_2,CANH,CANL,CURR_S_SIG,GND,MC_1_BRAKE_INPUT,MC_1_IMPULSE_INPUT,MC_1_REVERSE_SWITCH,MC_1_RXD,MC_1_THROTTLE_INPUT,MC_1_TXD,MC_2_BRAKE_INPUT,MC_2_IMPULSE_INPUT,MC_2_REVERSE_SWITCH,MC_2_RXD,MC_2_THROTTLE_INPUT,MC_2_TXD,PRESSURE_L_SIG_IN,PRESSURE_L_SIG_OUT,PRESSURE_R_SIG_IN,PRESSURE_R_SIG_OUT,TEMP_L_IN,TEMP+_L_OUT,TEMP-_L_OUT,TEMP_L_OUT,TEMP_R_IN,TEMP+_R_OUT,TEMP-_R_OUT,TEMP_R_OUT,TSAL_STATE

### Notes on the sheet
- CROSS_SHEET_CONNECTIONS

## Library data of the parts
5V_IND = adafruit:LED: LED OSRAM: - CHIPLED LG R971, LG N971, LY N971, LG Q971, LY Q971, LO R971, LY R971 LH N974, LH R974 LS Q976, LO Q976, LY Q976 LO Q996 - Hyper CHIPLED LW Q18S LB Q993, LB Q99A, LB R99A - SideLED LS A670, LO A670, LY A670, LG A670, LP A670 LB A673, LV A673, LT A673, LW A673 LH A674 LY A675 LS A676, LA A676, LO A676, LY A676, LW A676 LS A679, LY A679, LG A679 - Hyper Micro SIDELED® LS Y876, LA Y876, LO Y876, LY Y876 LT Y87S - SmartLED LW L88C, LW L88S LB L89C, LB L89S, LG L890 LS L89K, LO L89K, LY L89K LS L896, LA L896, LO L896, LY L896 - TOPLED LS T670, LO T670, LY T670, LG T670, LP T670 LSG T670, LSP T670, LSY T670, LOP T670, LYG T670 LG T671, LOG T671, LSG T671 LB T673, LV T673, LT T673, LW T673 LH T674 LS T676, LA T676, LO T676, LY T676, LB T676, LH T676, LSB T676, LW T676 LB T67C, LV T67C, LT T67C, LS T67K, LO T67K, LY T67K, LW E67C LS E67B, LA E67B, LO E67B, LY E67B, LB E67C, LV E67C, LT E67C LW T67C LS T679, LY T679, LG T679 LS T770, LO T770, LY T770, LG T770, LP T770 LB T773, LV T773, LT T773, LW T773 LH T774 LS E675, LA E675, LY E675, LS T675 LS T776, LA T776, LO T776, LY T776, LB T776 LHGB T686 LT T68C, LB T68C - Hyper Mini TOPLED® LB M676 - Mini TOPLED Santana® LG M470 LS M47K, LO M47K, LY M47K Source: http://www.osram.convergy.de/
ASS_TRIP AUDIO_OUT_TR BR_LIGHTS_TR1 = adafruit:MOSFET-N: N-Channel Mosfet 2N7002E - 60V 260mA SOT23 [Digikey: 2N7002ET1GOSTR-ND] - REEL BSH103 - 30V 850mA SOT23 [Digikey: 568-5013-1-ND]
C2-C10 C12 C13 = adafruit:C-US: CAPACITOR, American symbol
CAN_TERMINATION1 R1-R17 R21-R24 = adafruit:R-US_: RESISTOR, American symbol
D2 = diode:1N4004: DIODE general purpose rectifier, 1 A
F1 F2 = special:FUSE: FUSE 5 x 20 mm
IC4 = v-reg:LM317TS: VOLTAGE REGULATOR
J1-J4 J6 J8 = T821108A1S100CEU:T821108A1S100CEU: HEADER, VERTICAL, 2.54MM, 8WAY Amphenol T821 Series, 2.54mm Pitch 8 Way 2 Row Straight PCB Header, Solder Termination, 3A Source: Datasheet <http://uk.rs-online.com/web/p/products/1702738>; DESCRIPTION: HEADER, VERTICAL, 2.54MM, 8WAY Amphenol T821 Series, 2.54mm Pitch 8 Way 2 Row Straight PCB Header, Solder Termination, 3A; HEIGHT: 9.15mm; MANUFACTURER_NAME: Amphenol; MANUFACTURER_PART_NUMBER: T821108A1S100CEU; RS_PART_NUMBER: 1702738
JP1-JP4 = jumper:JP1Q: JUMPER
K1 = relay:RT44?*: Power PCB Relay SCHRACK 2 pole 8 A, DC and AC-coil Source: http://www.schrack.com/.. 5842.pdf; OC_FARNELL: unknown; OC_NEWARK: unknown
U1 = SparkFun-DiscreteSemi:LM4051: Adjustable Shunt Voltage Reference SOT-23 package without need for external capacitor. Adjustable from 1.24V to 10V. 60µA to 12mA SparkFun Products: SparkFun SparkPunk Sound Kit <https://www.sparkfun.com/products/11177> SparkFun ESP8266 Thing <https://www.sparkfun.com/products/13231>; PROD_ID: IC-13134; VALUE: LM4051
U2 = m-pad-2.1:MAX3232: max3232CD or max3232ID digikey parts: 296-13094-1-ND and 296-13098-1-ND respectively ~$2.60 (both 16pin soic narrow, but with different temperature grades) Texas Instruments 3V to 5.5V 250kbit multichannel RS-232 line driver/receiver with +-15kV ESD protection available as TI samples and digikey carries them as well, available in SOIC16 narrow/wide package and TSSOP as well. pin compatible with maxim-ic max232 and max3232 parts
U3 = SparkFun-IC-Amplifiers:LMV324: IC LMV324 Quad Op Amp Jellybean quad op-amp Datasheet <http://cdn.sparkfun.com/datasheets/Sensors/Sound/LMV324.pdf> SparkFun Products SparkFun Sensor Kit <https://www.sparkfun.com/products/13754> (DEV-13754) SparkFun Inventor's Kit for Arduino 101 <https://www.sparkfun.com/products/13844> (KIT-13844) SparkFun Sound Detector <https://www.sparkfun.com/products/12642> (SEN-12642); PROD_ID: IC-08227; VALUE: LMV324
U$1 = Oxford Uni Racing Custom Blueprints:SAME70-XPLD: SAME70-XPLD development board blueprint
U$3 = TCAN1042:TCAN1042
X1 X3 = con-wago-500:W237-102: WAGO SCREW CLAMP; MPN: 237-102; OC_FARNELL: unknown; OC_NEWARK: 70K9898
X2 = con-thomas-betts:D-SUB9-: D-Subminiatur Connector Source: Electronioc Interconnects European Edition 1998; OC_FARNELL: unknown; OC_NEWARK: unknown

## Board
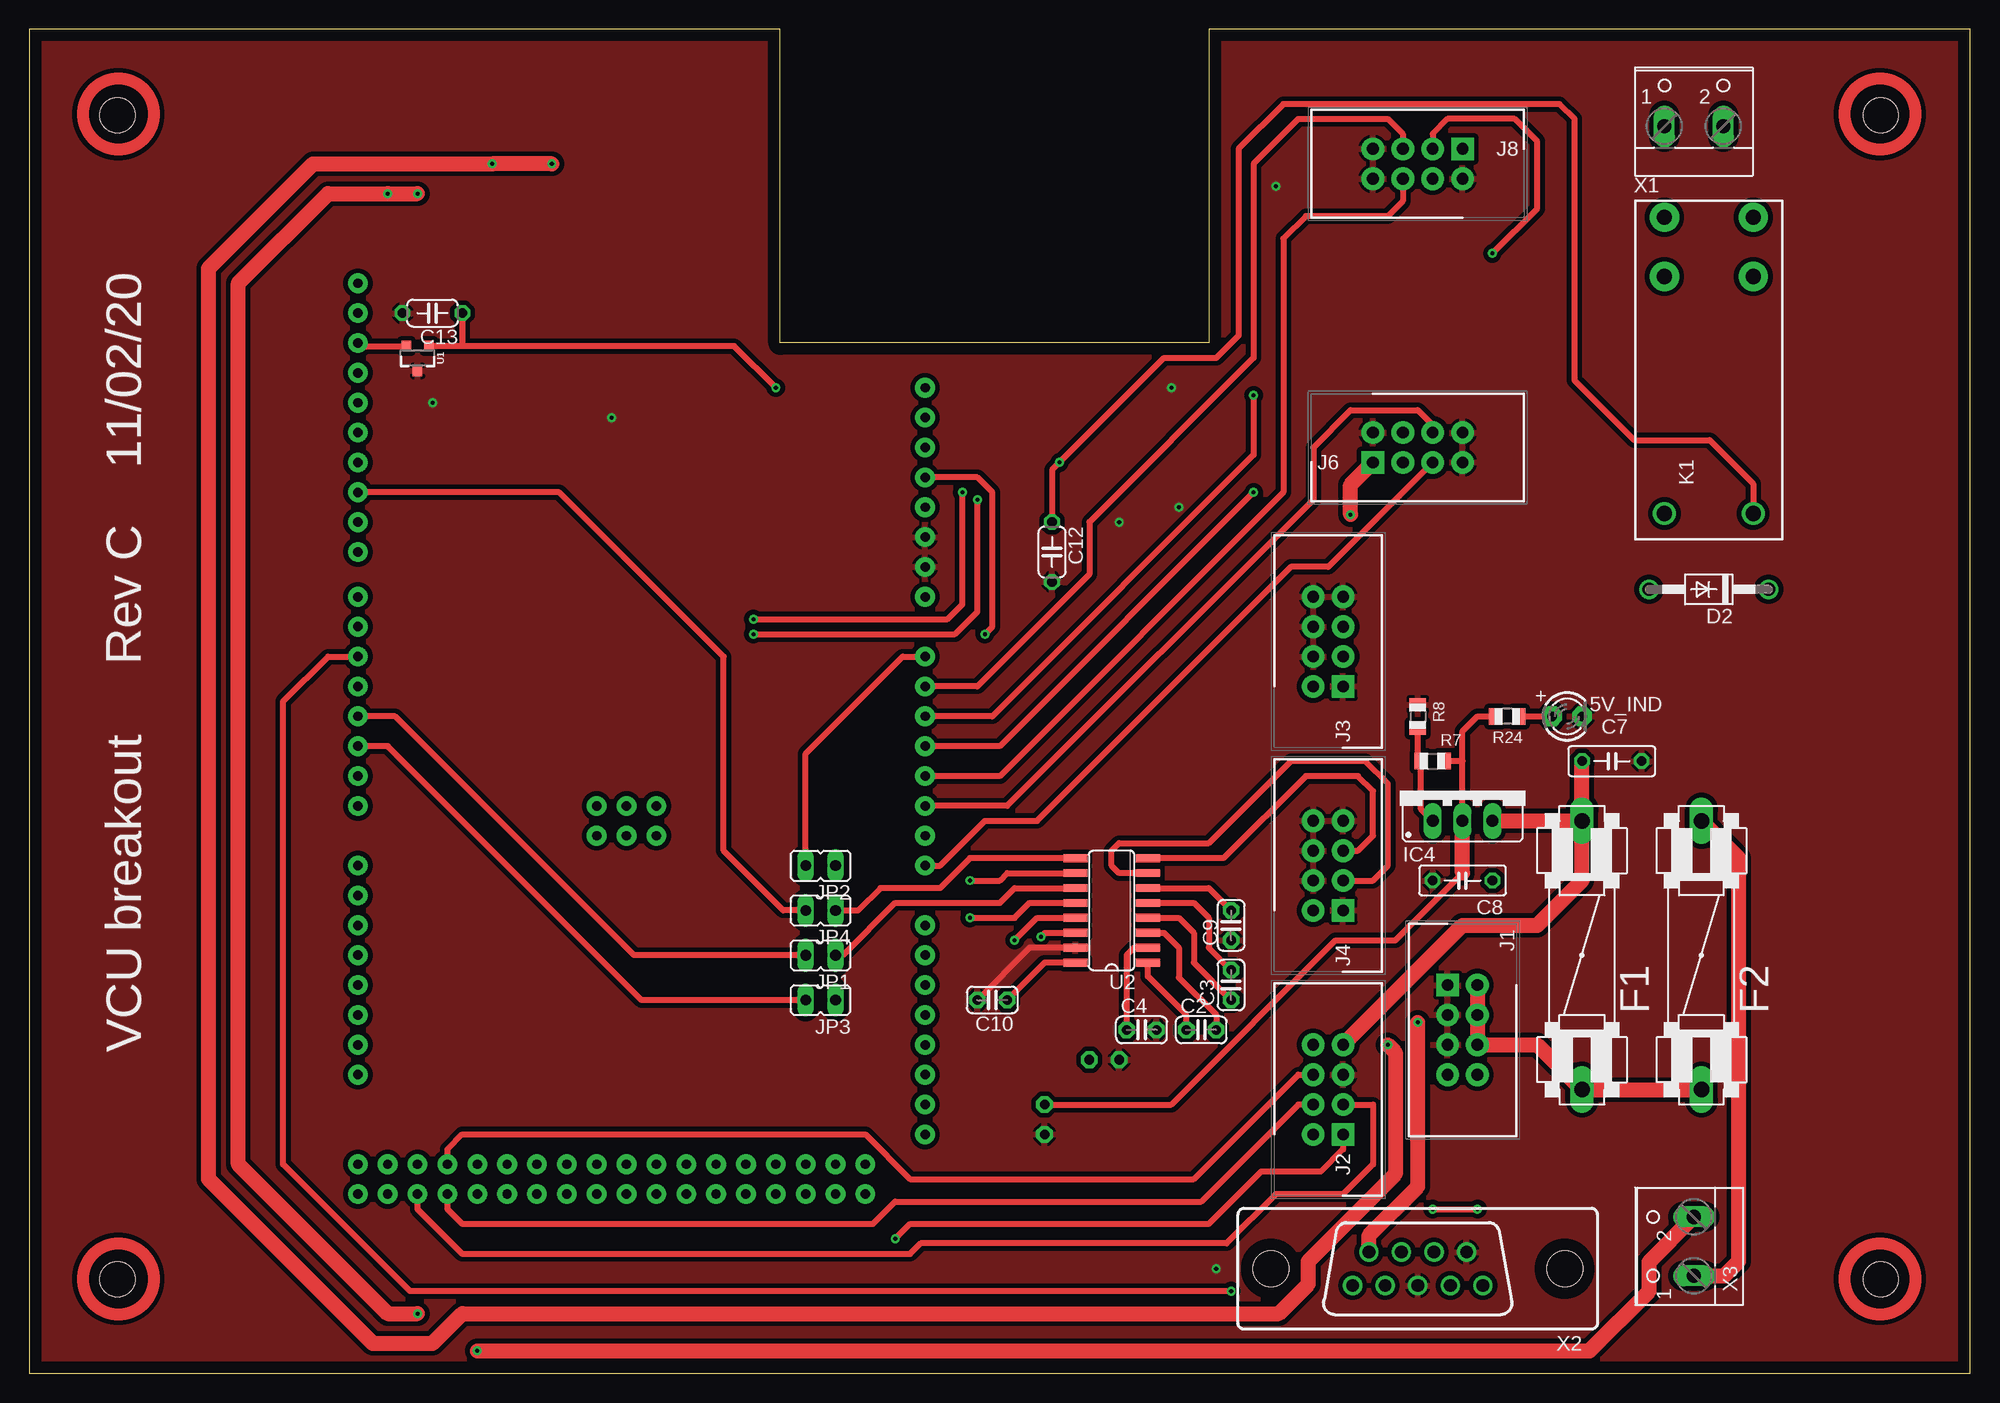
[diagram p7: board, top side]
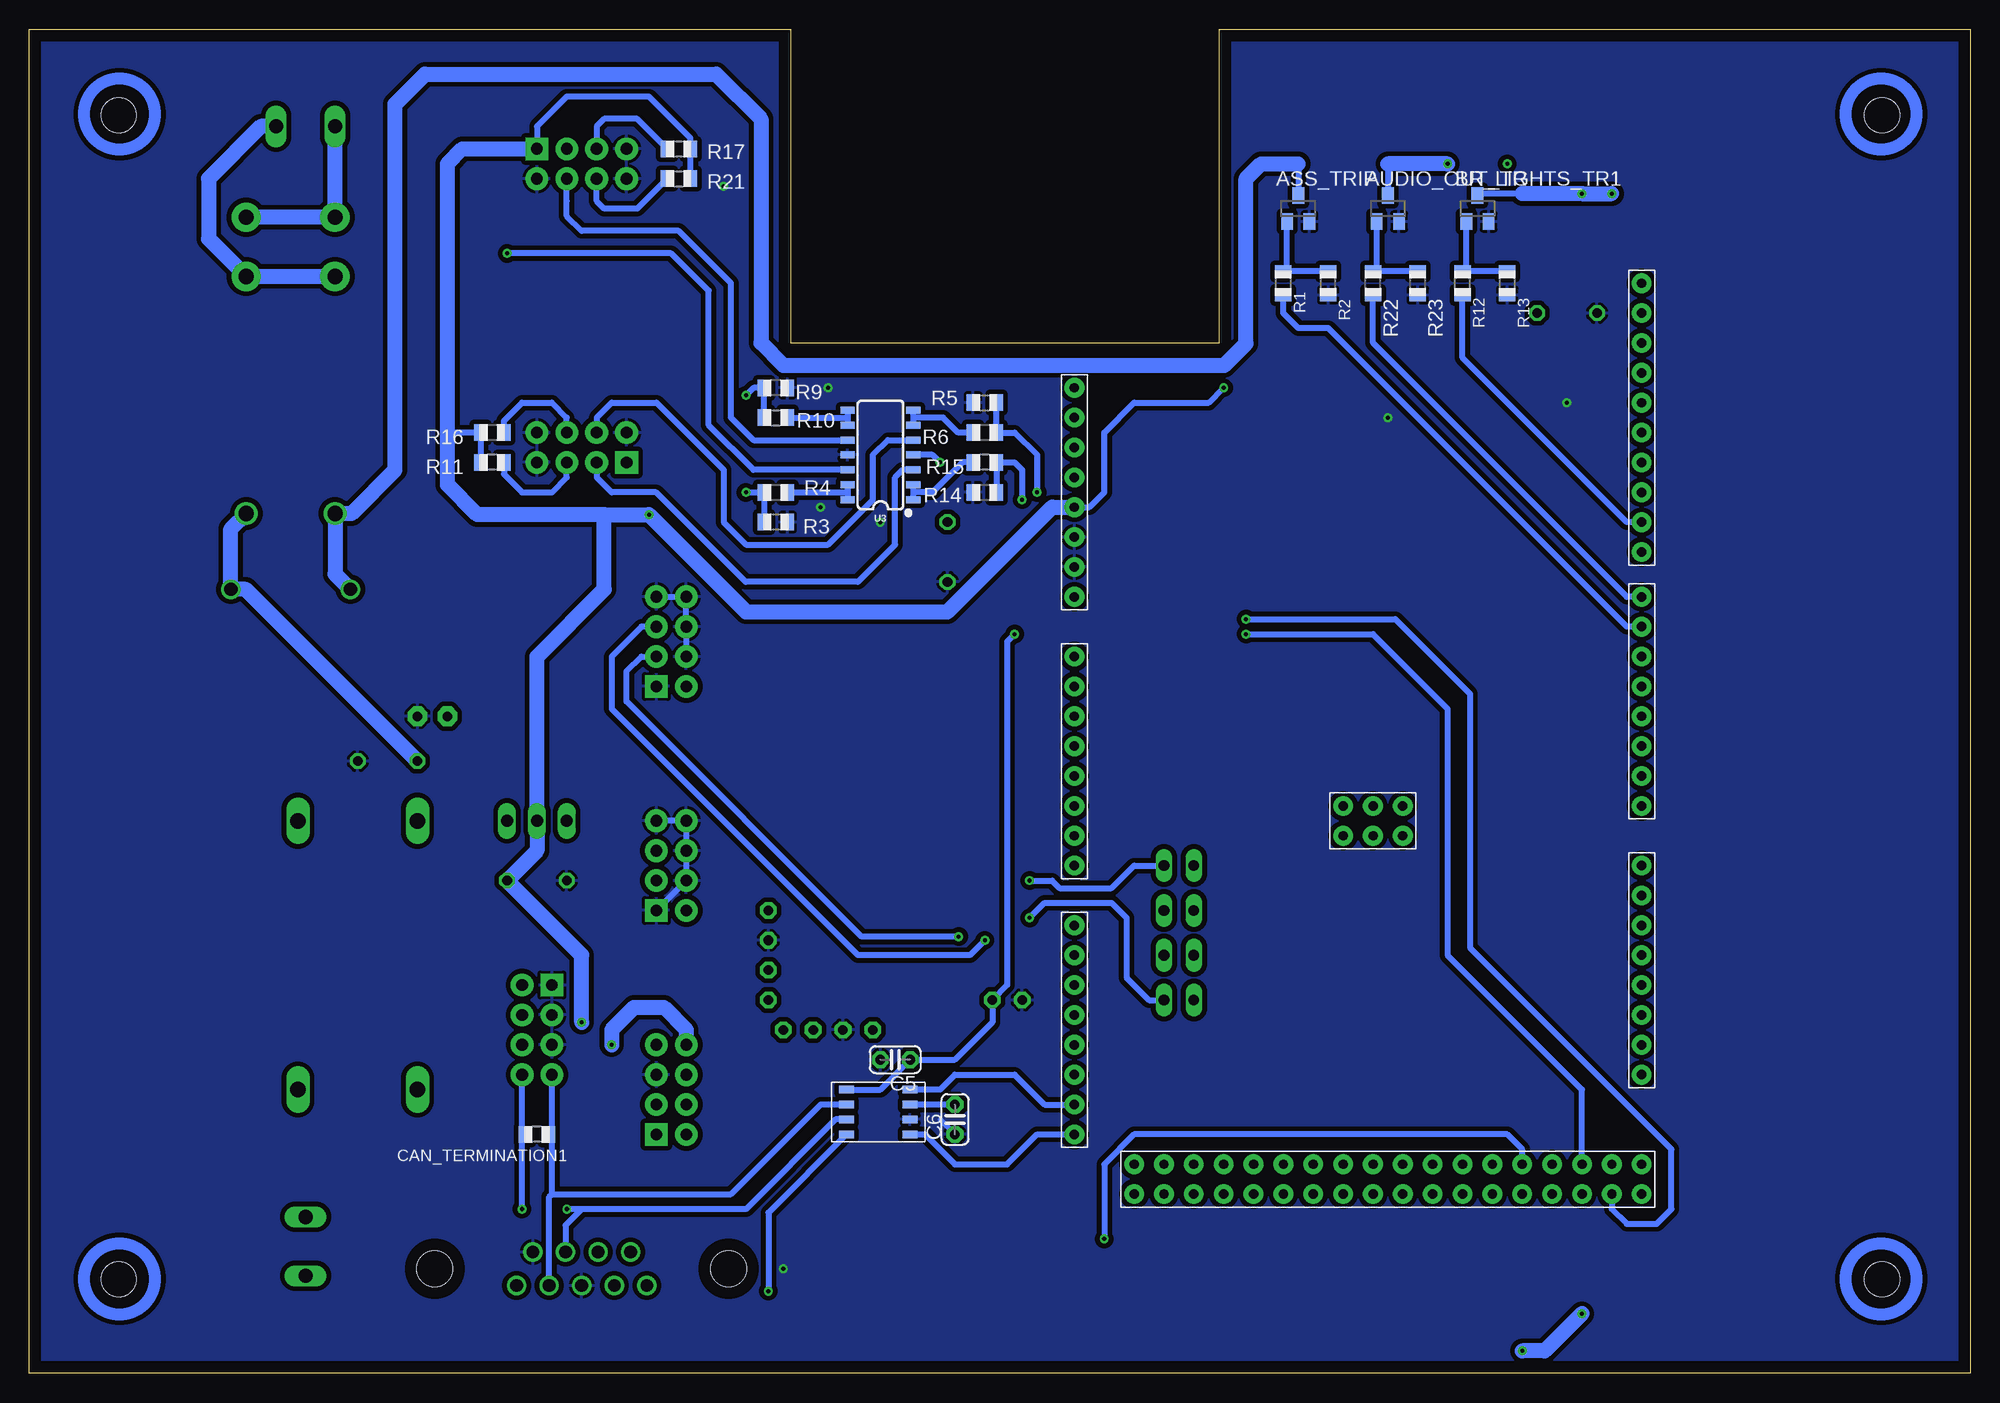
[diagram p8: board, bottom side, seen from below]

Size 165.1 x 114.3 mm. Coordinates in mm from the lower left corner, seen from the top.
Outline: 0,0 165.1,0 165.1,114.3 100.33,114.3 100.33,87.63 63.88,87.63 63.88,114.3 0,114.3 0,0
Copper layers (1*16): Top 0.035mm / dielectric 1.5mm / Bottom 0.035mm
Design rules "default *": minimum track width 6mil, minimum drill 0.35mm, track to track 16mil, track to pad 16mil, pad to pad 16mil, via to via 16mil, smd to smd 16mil, copper to edge 40mil, drill to drill 6mil, minimum pad ring 10mil, minimum via ring 8mil, stop-mask expansion 4mil, vias tented up to drill 0mil, thermal gap 10mil
Holes 3 mm at 7.5,8 7.5,107 157.5,107 157.5,8

### Footprints (pad centres in the part's own frame; a part is rotated, then mirrored left to right if it is on the bottom)
LED3MM = drill 0.813 pad 1.676 octagon: A -1.27,0; K 1.27,0
SOT23 = smd 1 x 1.4: 1 -0.95,-1.1; 2 0.95,-1.1; 3 0,1.1
C025-024X044 = drill 0.813 pad 1.422 octagon: 1 -1.27,0; 2 1.27,0
C050-025X075 = drill 0.813 octagon: 1 -2.54,0; 2 2.54,0
C050-024X044 = drill 0.813 octagon: 1 -2.54,0; 2 2.54,0
R0805 = smd 1.1 x 1.4: 1 -1,0; 2 1,0
DO41-10 = drill 1.118: A 5.08,0; C -5.08,0
FUSE = drill 1.321 long: 1 -11.43,0; 2 11.43,0
317TS = drill 1.016 long: 1 -2.54,-2.54; 2 0,-2.54; 3 2.54,-2.54
HDRV8W64P254_2X4_1778X895X915P = drill 1 pad 1.93 square: 1 0,0 | drill 1 pad 1.93: 2 0,2.54; 3 2.54,0; 4 2.54,2.54; 5 5.08,0; 6 5.08,2.54; 7 7.62,0; 8 7.62,2.54
JP1 = drill 0.914 long: 1 0,-1.27; 2 0,1.27
RT2N/O = drill 1.3 pad 2.5: 11 7.56,-3.78; 14 12.6,-3.78; 21 7.56,3.78; 24 12.6,3.78 | drill 1.3: A1 -12.6,-3.78; A2 -12.6,3.78
SOT23-3 = smd 0.8 x 0.9: 1 -0.95,-1; 2 0.95,-1; 3 0,1.1
SO16 = smd 0.66 x 2.032: 1 -4.445,-3.073; 2 -3.175,-3.073; 3 -1.905,-3.073; 4 -0.635,-3.073; 5 0.635,-3.073; 6 1.905,-3.073; 7 3.175,-3.073; 8 4.445,-3.073; 9 4.445,3.073; 10 3.175,3.073; 11 1.905,3.073; 12 0.635,3.073; 13 -0.635,3.073; 14 -1.905,3.073; 15 -3.175,3.073; 16 -4.445,3.073
SO14 = smd 0.6 x 1.2: 1 -3.175,-2.8; 2 -1.905,-2.8; 3 -0.635,-2.8; 4 0.635,-2.8; 5 1.905,-2.8; 6 3.175,-2.8; 7 4.445,-2.8; 8 4.445,2.8; 9 3.175,2.8; 10 1.905,2.8; 11 0.635,2.8; 12 -0.635,2.8; 13 -1.905,2.8; 14 -3.175,2.8
SAME70-XPLD = drill 0.8 pad 1.676: J506-0 27.94,27.94; J506-1 25.4,27.94; J506-2 22.86,27.94; J506-3 22.86,25.4; J506-4 25.4,25.4; J506-5 27.94,25.4; J5000 48.26,72.39; J5001 48.26,69.85; J5002 48.26,67.31; J5003 48.26,64.77; J5004 48.26,62.23; J5005 48.26,59.69; J5006 48.26,57.15; J5007 48.26,54.61; J5008 48.26,52.07; J5009 48.26,49.53; J5010 0,63.5; J5011 0,60.96; J5012 0,58.42; J5013 0,55.88; J5014 0,53.34; J5015 0,50.8; J5016 0,48.26; J5017 0,45.72; J5020 0,40.64; J5021 0,38.1; J5022 0,35.56; J5023 0,33.02; J5024 0,30.48; J5025 0,27.94; J5026 0,25.4; J5027 0,22.86; J5030 48.26,45.72; J5031 48.26,43.18; J5032 48.26,40.64; J5033 48.26,38.1; J5034 48.26,35.56; J5035 48.26,33.02; J5036 48.26,30.48; J5037 48.26,27.94; J5040 0,17.78; J5041 0,15.24; J5042 0,12.7; J5043 0,10.16; J5044 0,7.62; J5045 0,5.08; J5046 0,2.54; J5047 0,0; J5050 48.26,22.86; J5051 48.26,20.32; J5052 48.26,17.78; J5053 48.26,15.24; J5054 48.26,12.7; J5055 48.26,10.16; J5056 48.26,7.62; J5057 48.26,5.08; J5070 48.26,-2.54; J5071 45.72,-2.54; J5072 43.18,-2.54; J5073 40.64,-2.54; J5074 38.1,-2.54; J5075 35.56,-2.54; J5076 33.02,-2.54; J5077 30.48,-2.54; J5078 27.94,-2.54; J5079 25.4,-2.54; J50710 22.86,-2.54; J50711 20.32,-2.54; J50712 17.78,-2.54; J50713 15.24,-2.54; J50714 12.7,-2.54; J50715 10.16,-2.54; J50716 7.62,-2.54; J50717 5.08,-2.54; J50718 5.08,-5.08; J50719 7.62,-5.08; J50720 10.16,-5.08; J50721 12.7,-5.08; J50722 15.24,-5.08; J50723 17.78,-5.08; J50724 20.32,-5.08; J50725 22.86,-5.08; J50726 25.4,-5.08; J50727 27.94,-5.08; J50728 30.48,-5.08; J50729 33.02,-5.08; J50730 35.56,-5.08; J50731 38.1,-5.08; J50732 40.64,-5.08; J50733 43.18,-5.08; J50734 45.72,-5.08; J50735 48.26,-5.08
TCAN1042 = smd 1.27 x 0.635: PIN_0 6.35,2.54; PIN_1 6.35,1.27; PIN_2 6.35,0; PIN_3 6.35,-1.27; PIN_4 11.76,-1.27; PIN_5 11.76,0; PIN_6 11.76,1.27; PIN_7 11.76,2.54
W237-102 = drill 1.194 long: 1 -2.5,-1.27; 2 2.5,-1.27
H2M09ST = drill 1.092: 1 -5.537,1.422; 2 -2.769,1.422; 3 0,1.422; 4 2.769,1.422; 5 5.537,1.422; 6 -4.153,-1.422; 7 -1.384,-1.422; 8 1.384,-1.422; 9 4.153,-1.422 | hole 3.048: -12.497,0; 12.497,0

### Placement (x,y rotation side)
5V_IND  130.81,55.88 0 top
ASS_TRIP  57.15,99.06 0 bottom
AUDIO_OUT_TR  49.53,99.06 0 bottom
BR_LIGHTS_TR1  41.91,99.06 0 bottom
C2  99.69,29.21 0 top
C3  102.23,33.02 90 top
C4  94.61,29.21 0 top
C5  91.44,26.67 180 bottom
C6  86.36,21.59 270 bottom
C7  134.62,52.07 0 top
C8  121.92,41.91 180 top
C9  102.23,38.1 270 top
C10  81.92,31.75 180 top
C12  87,69.85 270 top
C13  34.29,90.17 180 top
CAN_TERMINATION1  121.92,20.32 180 bottom
D2  142.88,66.67 180 top
F1  132.08,35.56 90 top
F2  142.24,35.56 90 top
IC4  121.92,49.53 0 top
J1  120.65,33.02 270 top
J2  111.76,20.32 90 top
J3  111.76,58.42 90 top
J4  111.76,39.37 90 top
J6  114.3,77.47 0 top
J8  121.92,104.14 180 top
JP1  67.31,35.56 90 top
JP2  67.31,43.18 90 top
JP3  67.31,31.75 90 top
JP4  67.31,39.37 90 top
K1  142.88,85.72 90 top
R1  58.42,92.71 90 bottom
R2  54.61,92.71 90 bottom
R3  101.6,72.39 180 bottom
R4  101.6,74.93 0 bottom
R5  83.82,82.55 0 bottom
R6  83.82,80.01 180 bottom
R7  119.38,52.07 0 top
R8  118.11,55.88 270 top
R9  101.6,83.82 180 bottom
R10  101.6,81.28 0 bottom
R11  125.73,77.47 180 bottom
R12  43.18,92.71 90 bottom
R13  39.37,92.71 90 bottom
R14  83.82,74.93 0 bottom
R15  83.82,77.47 180 bottom
R16  125.73,80.01 180 bottom
R17  109.86,104.14 0 bottom
R21  109.86,101.6 0 bottom
R22  50.8,92.71 90 bottom
R23  46.99,92.71 90 bottom
R24  125.73,55.88 180 top
U1  33.02,86.36 180 top
U2  92.08,39.37 90 top
U3  92.71,77.47 90 bottom
U$1  76.2,20.32 0 bottom
U$3  83.82,22.86 180 bottom
X1  141.6,107.31 0 top
X2  118.11,8.89 180 top
X3  140.34,10.79 90 top

### Tracks (layer width: path | path; a pad name or v marks a point on that pad's centre or on a via)
3.3V  (via drill 0.35)
  Top 0.508: v81.28,62.87 81.92,63.5 81.92,74.93 80.64,76.2 U$1.J5013 | U2.16 86.36,34.92 C10.1
  Bottom 0.508: v81.28,62.87 81.92,62.23 81.92,33.02 C10.1 83.19,29.84 86.36,26.67 C5.1 92.71,24.13 U$3.PIN_4
5V  (via drill 0.35)
  Top 0.508: 121.92,52.07 R7.2 | R24.2 123.19,55.88 121.92,54.61 121.92,52.07 | 36.83,87.36 59.96,87.36 v63.5,83.82 | 36.83,87.36 U1.1 | IC4.2 121.92,52.07 | C13.1 36.83,87.36 | 121.92,42.55 116.2,36.83 111.12,36.83 97.16,22.86 C6.1
  Top 1.27: 121.92,42.55 IC4.2 | v112.39,73.03 112.39,75.56 J6.1 | v118.11,29.84 118.11,15.88 113.96,11.72 X2.9
  Bottom 0.508: C6.1 U$3.PIN_2 | R11.2 R16.2 129.54,80.01 | U$1.J5014 74.93,73.66 73.66,74.93 73.66,80.01 71.12,82.55 64.77,82.55 v63.5,83.82 | R21.2 R17.2 108.86,105.05 112.39,108.58 119.38,108.58 121.92,106.05 J8.1
  Bottom 1.27: 116.2,73.03 116.2,66.67 121.92,60.96 IC4.2 121.92,44.45 C8.1 118.11,35.56 v118.11,29.84 | 116.2,73.03 v112.39,73.03 104.14,64.77 87,64.77 78.11,73.66 U$1.J5014 | 116.2,73.03 127,73.03 129.54,75.56 129.54,80.01 129.54,102.87 128.27,104.14 J8.1
12V  (via drill 0.35)
  Top 0.508: K1.A1 146.66,75.67 142.95,79.38 136.53,79.38 131.44,84.45 131.44,106.68 130.18,107.95 106.68,107.95 102.87,104.14 102.87,88.27 100.97,86.36 96.52,86.36 v87.63,77.47 87,76.83 C12.1
  Top 1.27: J2.7 121.92,38.1 128.27,38.1 132.08,41.91 F1.2 | IC4.3 F1.2 | F1.2 C7.1
  Bottom 0.508: v87.63,77.47 88.27,78.11 U3.4
  Bottom 1.27: K1.A1 147.96,71.83 D2.C 146.69,66.67 C7.1
12V_BATTERY
  Top 1.27: J1.2 J1.4 J1.6 128.27,27.94 F1.1 F2.1
AIR_C_1
  Top 0.508: J2.3 114.3,22.86 114.3,17.78 111.76,15.24 106.05,15.24 101.85,11.05 75.82,11.05 74.93,10.16 36.83,10.16 33.02,13.97 U$1.J50733
AIR_C_2
  Top 0.508: J2.4 107.95,22.86 99.69,14.61 73.66,14.61 71.75,12.7 36.83,12.7 35.56,13.97 U$1.J50732
AIR_C_3
  Top 0.508: U$1.J5073 35.56,19.05 36.83,20.32 71.12,20.32 74.93,16.51 99.06,16.51 107.95,25.4 J2.6
ASS1
  Bottom 1.27: K1.14 K1.24 139.09,106.03 X1.1
ASS2
  Bottom 1.27: X1.2 145.41,106.05 149.86,101.6 149.86,96.49 K1.11 K1.21
AUDIO_OUT
  Bottom 0.508: U$1.J5030 29.21,66.04 50.8,87.63 R22.1
AUDIO_OUT-  (via drill 0.35)
  Top 1.27: v44.45,102.87 v39.37,102.87 24.13,102.87 15.24,93.98 15.24,16.51 29.21,2.54 34.29,2.54 36.83,5.08 106.29,5.08 108.79,7.58 108.79,9.53 116.2,16.94 116.2,27.3 v115.57,27.94
  Bottom 0.508: 49.53,102.87 AUDIO_OUT_TR.3
  Bottom 1.27: v44.45,102.87 49.53,102.87 | v115.57,27.94 115.57,29.21 113.67,31.11 111.12,31.11 109.22,29.21 J2.8
BRAKE_LIGHTS+
  Top 1.27: X3.1 144.19,8.29 145.41,9.53 145.41,43.81 F2.2
BRAKE_LIGHTS-  (via drill 0.35)
  Top 1.27: v33.02,100.33 v30.48,100.33 25.4,100.33 17.78,92.71 17.78,17.78 30.48,5.08 v33.02,5.08 | v38.1,1.91 132.72,1.91 137.79,6.99 137.79,9.48 X3.2
  Bottom 0.508: 38.1,100.33 41.74,100.33 BR_LIGHTS_TR1.3
  Bottom 1.27: 38.1,100.33 v33.02,100.33 v30.48,100.33 | v33.02,5.08 36.2,1.91 v38.1,1.91
BRAKE_LIGHTS_OUT
  Bottom 0.508: U$1.J5008 29.21,72.39 43.18,86.36 R12.1
CAN_STANDBY  (via drill 0.35)
  Top 0.508: U$1.J5032 25.4,60.96 21.59,57.15 21.59,17.78 31.11,8.26 31.75,7.62 32.38,6.99 v102.23,6.99
  Bottom 0.508: U$3.PIN_7 102.23,13.66 v102.23,6.99
CANH  (via drill 0.35)
  Top 0.508: v119.38,13.97 v123.19,13.97
  Bottom 0.508: U$3.PIN_6 96.52,21.59 104.14,13.97 118.11,13.97 | 118.11,13.97 119.49,12.59 X2.7 | 118.11,13.97 v119.38,13.97 | v123.19,13.97 123.19,20.32 | 123.19,20.32 J1.8 | CAN_TERMINATION1.2 123.19,20.32
CANL
  Bottom 0.508: U$3.PIN_5 97.79,22.86 105.41,15.24 120.65,15.24 | X2.2 120.88,15.01 120.65,15.24 | 120.65,15.24 120.65,20.32 | 120.65,20.32 J1.7 | CAN_TERMINATION1.1 120.65,20.32
GND  (via drill 0.35)
  Top 0.508: U2.15 85.09,36.2 C10.2
  Bottom 0.406: 87.63,21.59 C6.2
  Bottom 0.508: J4.1 J4.4 J4.8 J4.7 | J3.7 J3.8 J3.6 J3.4
  Bottom 1.27: 122.26,10.5 X2.6
  other vias: 97.16,83.82 97.79,73.66 34.29,82.55 92.71,72.39 49.53,81.28 100.97,8.89 106.05,100.97
  pour Bottom (isolate 0.406): 0,114.3 0,0 165.1,0 165.1,114.3
  pour Top (isolate 0.406): 0,0 165.74,0 165.74,114.3 0,114.3
MC_1_RXD  (via drill 0.35)
  Top 0.508: v86.05,37.14 86.38,37.47 U2.14
  Bottom 0.508: J3.3 113.03,60.96 114.3,59.69 114.3,57.15 94.29,37.14 v86.05,37.14
MC_1_TXD  (via drill 0.35)
  Top 0.508: U2.13 85.72,38.73 v83.82,36.83
  Bottom 0.508: v83.82,36.83 85.09,35.56 94.61,35.56 115.57,56.52 115.57,60.96 113.03,63.5 J3.5
MC_2_RXD
  Top 0.508: J4.3 114.3,41.91 115.57,43.18 115.57,50.16 113.67,52.07 107.31,52.07 100.33,45.09 92.71,45.09 92.08,44.45 92.08,43.18 92.71,42.55 U2.7
MC_2_TXD
  Top 0.508: J4.5 113.03,44.45 114.3,45.72 114.3,49.53 113.03,50.8 108.58,50.8 101.6,43.81 U2.8
MCU_1_RXD
  Top 0.508: JP3.2 52.07,31.75 30.48,53.34 U$1.J5035
MCU_1_TXD
  Top 0.508: JP1.2 51.44,35.56 31.11,55.88 U$1.J5034
MCU_2_RXD
  Top 0.508: JP4.2 64.14,39.37 59.05,44.45 59.05,60.96 45.09,74.93 U$1.J5007
MCU_2_TXD
  Top 0.508: JP2.2 66.04,52.7 74.3,60.96 U$1.J5020
N$1
  Bottom 0.508: U$1.J5031 29.21,63.5 54.61,88.9 57.15,88.9 58.42,90.17 R1.1
N$2
  Top 0.508: R24.1 5V_IND.A
N$3
  Bottom 0.508: R2.2 R1.2 58.1,94.03 ASS_TRIP.1
N$4
  Top 0.508: IC4.1 118.38,47.99 R7.1 118.11,52.34 R8.2
N$6
  Bottom 0.508: 57.15,102.87 ASS_TRIP.3
  Bottom 1.27: D2.A 139.09,67.97 K1.A2 137.69,73.12 133.99,76.83 133.99,107.95 131.44,110.49 106.68,110.49 102.87,106.68 102.87,87.63 100.97,85.72 63.45,85.72 61.59,87.58 61.59,101.6 60.33,102.87 57.15,102.87
N$8
  Top 0.508: U2.5 99.06,40.01 100.33,38.73 100.33,36.2 C3.2
N$9
  Top 0.508: U2.4 97.79,38.73 99.06,37.47 99.06,34.92 C3.1
N$10
  Top 0.508: U2.3 96.52,37.47 97.79,36.2 97.79,33.66 100.97,30.48 C2.2
N$11
  Top 0.508: C2.1 98.42,30.48 95.15,33.76 U2.1
N$12
  Top 0.508: U$1.J5002 28.21,87.36 U1.2
N$13
  Bottom 0.508: U3.13 95.51,74.93 | 95.51,74.93 U3.14 | R4.2 95.51,74.93
N$14
  Top 0.508: U2.2 93.98,36.2 93.34,35.56 C4.1
N$15
  Top 0.508: U2.6 100.33,41.27 C9.1
N$16
  Top 0.508: U2.11 83.82,41.27 82.55,40.01 73.66,40.01 69.22,35.56 JP1.1
N$17
  Bottom 0.508: R6.2 86.09,80.01 87.36,81.28 89.91,81.28 | U3.7 89.91,81.28 | 89.91,81.28 U3.6
N$18  (via drill 0.35)
  Top 0.508: U2.10 83.19,42.55 82.55,41.91 v80.01,41.91
  Bottom 0.508: v80.01,41.91 78.11,41.91 77.47,41.27 73.03,41.27 71.12,43.18 JP2.1
N$19
  Bottom 0.508: U3.8 95.51,81.28 | 95.51,81.28 U3.9 | R10.2 95.51,81.28
N$20  (via drill 0.35)
  Top 0.508: U2.12 85.09,40.01 83.82,38.73 v80.01,38.73
  Bottom 0.508: v80.01,38.73 78.74,40.01 73.03,40.01 71.75,38.73 71.75,33.66 69.85,31.75 JP3.1
N$21
  Bottom 0.508: R15.2 85.72,77.47 88.27,74.93 89.91,74.93 | U3.2 89.91,74.93 | 89.91,74.93 U3.1
N$22
  Top 0.508: JP4.1 70.48,39.37 72.39,41.27 77.47,41.27 80.01,43.81 U2.9
N$23
  Bottom 0.508: R23.2 R22.2 50.48,94.03 AUDIO_OUT_TR.1
N$25
  Bottom 0.508: R13.2 R12.2 42.86,94.03 BR_LIGHTS_TR1.1
PRESSURE_L_SIG_IN  (via drill 0.35)
  Top 0.508: v80.64,74.3 80.64,64.77 78.74,62.87 v61.59,62.87
  Bottom 0.508: U$1.J5072 33.02,24.13 44.45,35.56 44.45,56.52 50.8,62.87 v61.59,62.87 | R14.2 R15.1 81.28,77.47 80.64,76.83 v80.64,74.3
PRESSURE_L_SIG_IN_UNREG
  Bottom 0.508: U3.3 90.81,76.83 91.44,76.2 91.44,70.48 94.61,67.31 104.16,67.31 111.78,74.93 115.57,74.93 116.84,76.2 J6.3
PRESSURE_L_SIG_OUT  (via drill 0.35)
  Top 0.508: v79.38,74.93 79.38,65.41 78.11,64.14 v61.59,64.14
  Bottom 0.508: U$1.J50734 30.48,13.97 29.21,12.7 26.67,12.7 25.4,13.97 25.4,19.05 42.55,36.2 42.55,57.78 48.9,64.14 v61.59,64.14 | R5.2 R6.1 81.28,80.01 79.38,78.11 v79.38,74.93
PRESSURE_L_SIG_OUT_UNREG
  Bottom 0.508: J6.4 116.84,81.28 115.57,82.55 111.76,82.55 106.05,76.83 106.05,72.39 104.14,70.48 97.16,70.48 93.34,74.3 93.34,78.11 92.08,79.38 U3.5
PRESSURE_R_SIG_IN  (via drill 0.35)
  Top 0.508: U$1.J5023 82.55,53.34 v104.14,74.93
  Bottom 0.508: R3.2 R4.1 v104.14,74.93
PRESSURE_R_SIG_IN_UNREG  (via drill 0.35)
  Top 0.508: v124.46,95.25 128.27,99.06 128.27,104.78 126.36,106.68 120.65,106.68 119.38,105.41 J8.3
  Bottom 0.508: U3.12 103.5,76.83 107.31,80.64 107.31,92.08 110.49,95.25 v124.46,95.25
PRESSURE_R_SIG_OUT  (via drill 0.35)
  Top 0.508: v104.14,83.19 104.14,78.11 81.92,55.88 U$1.J5022
  Bottom 0.508: R10.1 R9.2 103.5,83.82 v104.14,83.19
PRESSURE_R_SIG_OUT_UNREG
  Bottom 0.508: U3.10 103.5,79.38 105.41,81.28 105.41,92.71 109.86,97.16 118.11,97.16 119.38,98.42 119.38,99.69 119.38,100.97 J8.4
RXD
  Bottom 0.508: U$3.PIN_3 87.63,24.13 86.36,25.4 81.28,25.4 78.74,22.86 U$1.J5046
TEMP_L_IN
  Top 0.508: U$1.J5027 77.47,43.18 81.28,46.99 85.72,46.99 107.31,68.58 110.49,68.58 J6.5
  Bottom 0.508: R11.1 124.73,76.47 123.19,74.93 120.65,74.93 119.38,76.2 J6.5
TEMP_L_OUT
  Top 0.508: U$1.J5025 83.19,48.26 109.22,74.3 109.22,78.74 112.39,81.92 118.11,81.92 119.38,80.64 J6.6
  Bottom 0.508: J6.6 119.38,81.28 120.65,82.55 123.19,82.55 124.73,81.01 R16.1
TEMP_R_IN
  Top 0.508: J8.5 116.84,105.41 115.57,106.68 107.95,106.68 104.14,102.87 104.14,86.36 90.17,72.39 90.17,67.94 80.64,58.42 U$1.J5021
  Bottom 0.508: R17.1 113.39,106.68 116.2,106.68 116.84,106.05 J8.5
TEMP_R_OUT
  Top 0.508: J8.6 116.84,99.69 115.57,98.42 108.58,98.42 106.68,96.52 106.68,74.93 82.55,50.8 U$1.J5024
  Bottom 0.508: R21.1 113.39,99.06 116.2,99.06 116.84,99.69 J8.6
TSAL_STATE  (via drill 0.35)
  Top 0.508: J2.1 111.76,19.05 109.86,17.14 104.78,17.14 100.33,12.7 74.93,12.7 v73.66,11.43
  Bottom 0.508: v73.66,11.43 73.66,17.78 71.12,20.32 39.37,20.32 38.1,19.05 U$1.J5074
TXD
  Bottom 0.508: U$3.PIN_0 88.9,20.32 86.36,17.78 81.92,17.78 79.38,20.32 U$1.J5047
(copper drawn outside any net)
  shapes: Bottom circle x4, Top circle x4

### Text on the board
tPlace: VCU breakout Rev C 11/02/20